# EasyEDA Pro project ProProject_高通AI开发板9.7.epro, schematic Schematic1

## Sheets
1 cam_mem: Create Date: 2024-09-07; Page Name: cam_mem; Project Name: 高通AI开发板9.7; Schematic Name: Schematic1; Update Date: 2024-09-07; Company: 嘉立创EDA; Page Size: A4; Version: V1.0
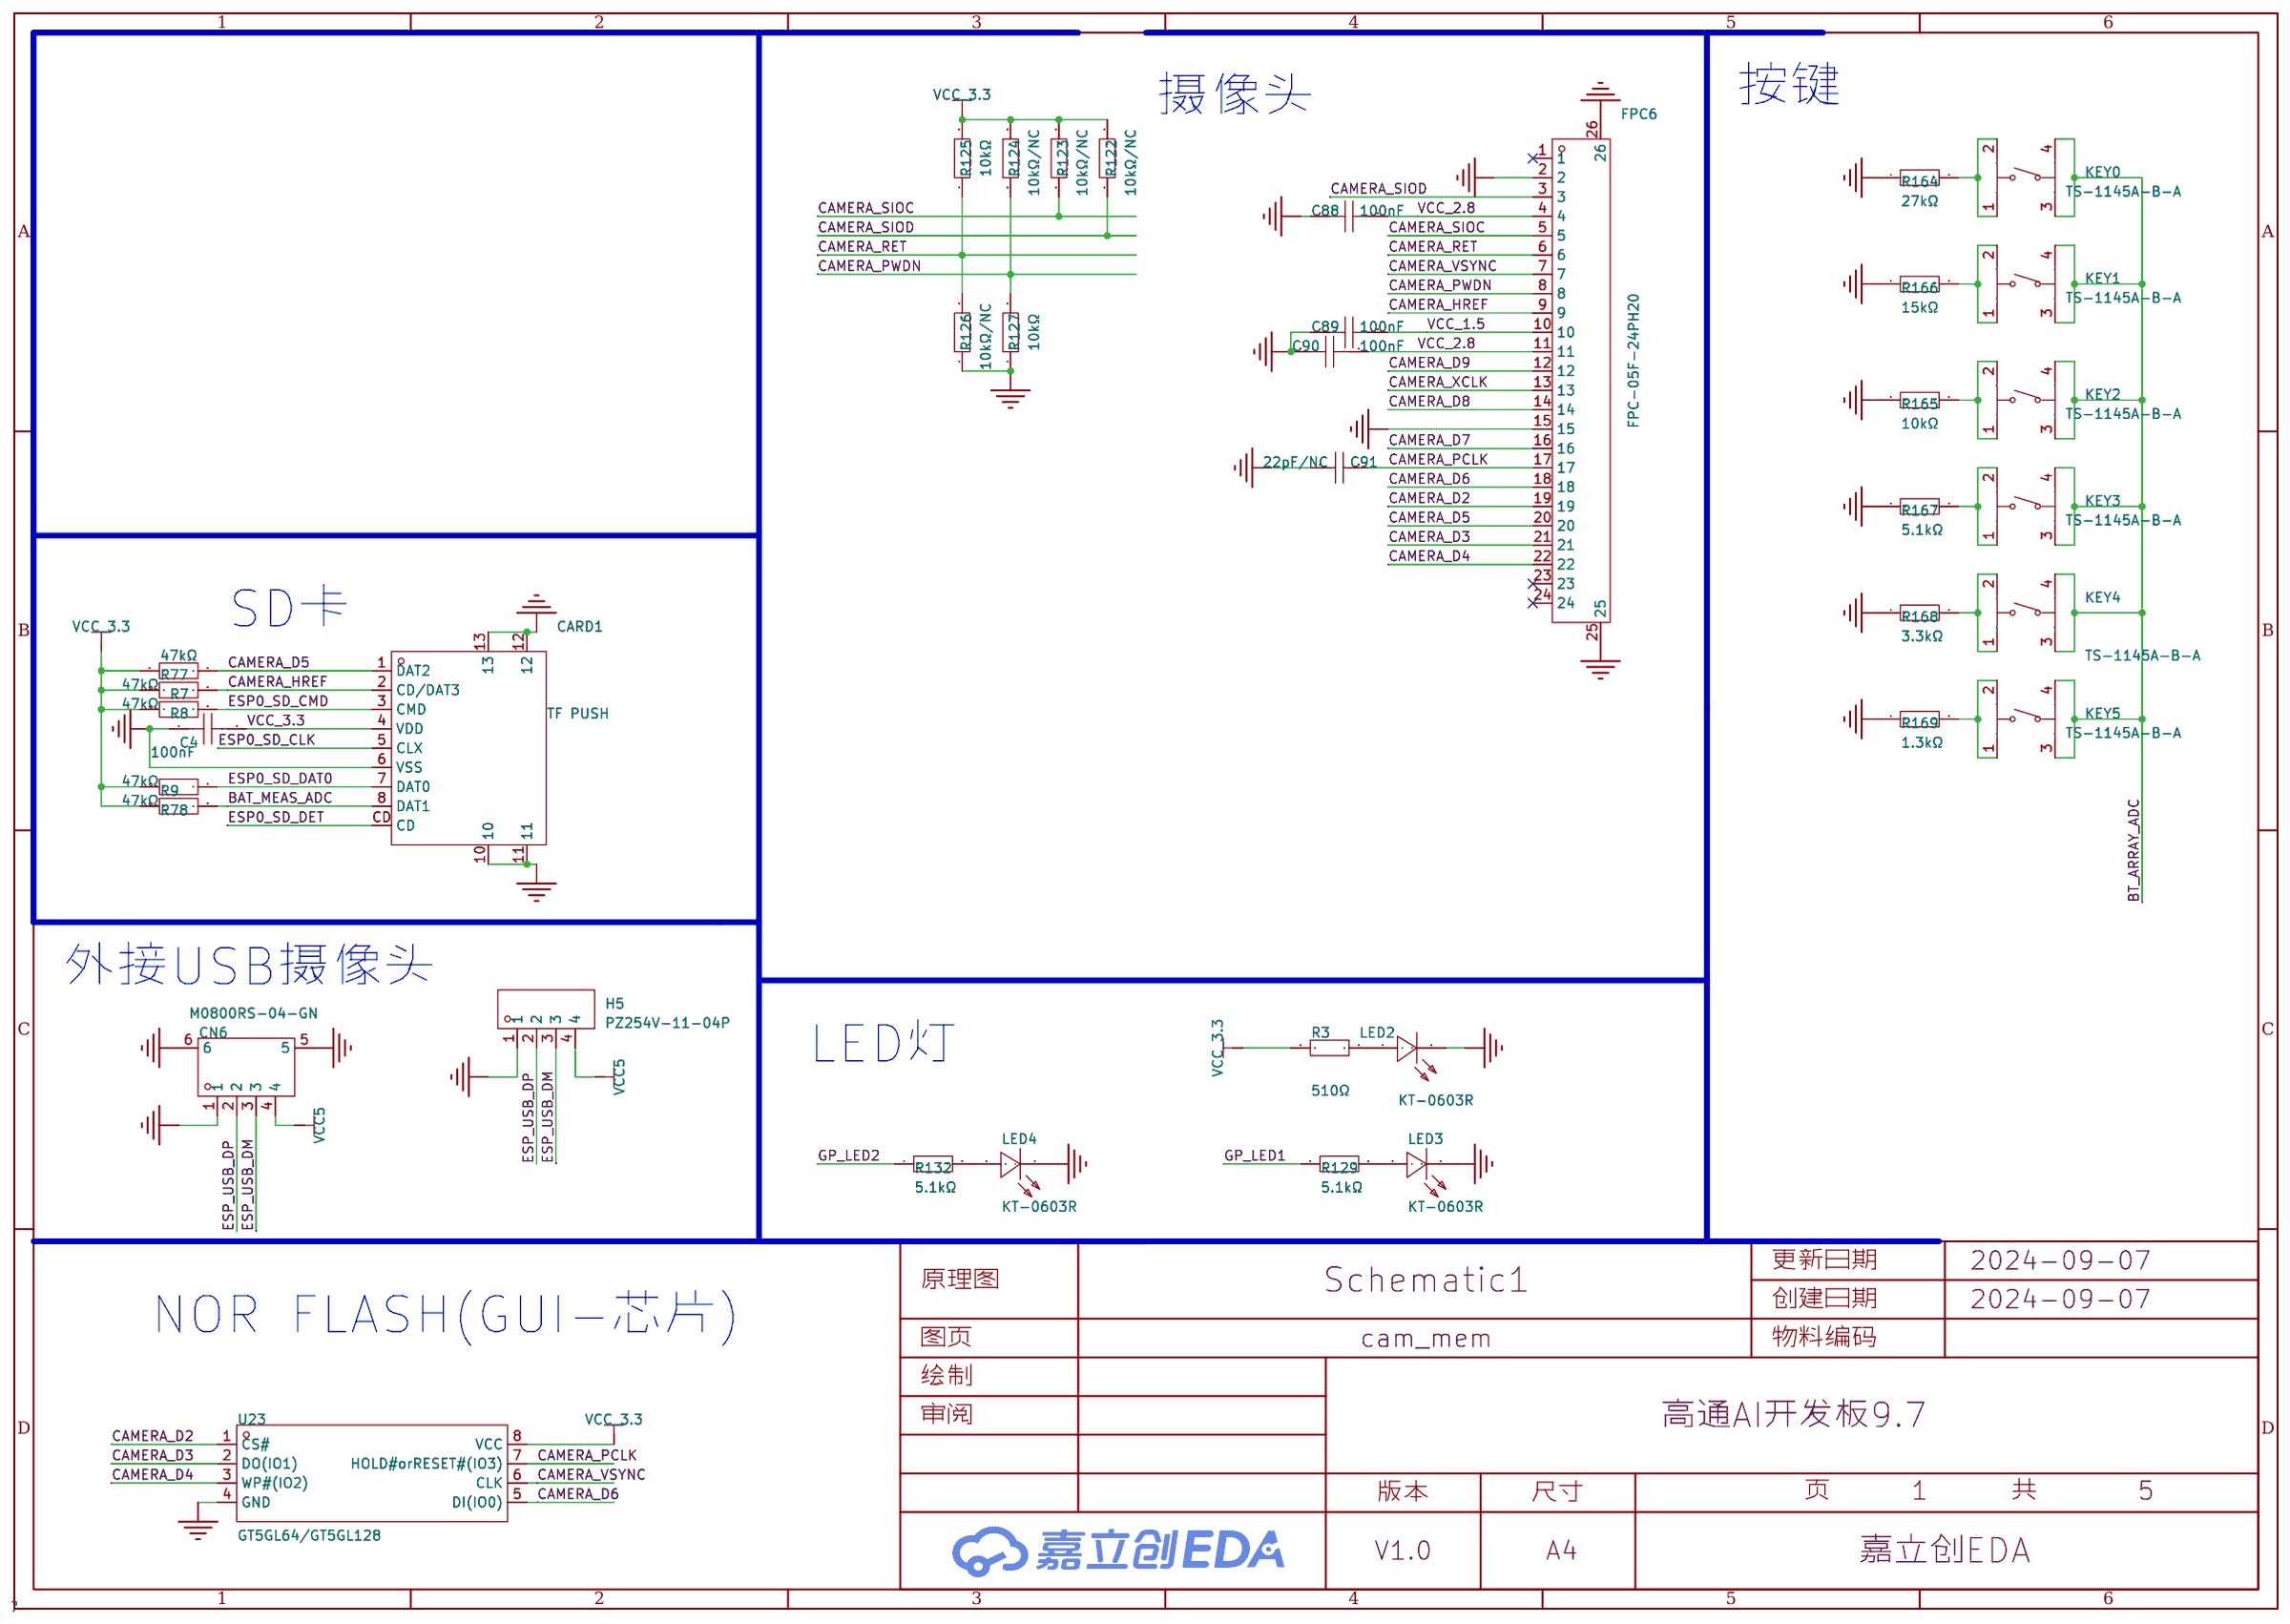
[diagram p0: cam_mem]
2 lcd_usb_uart: Page Name: lcd_usb_uart
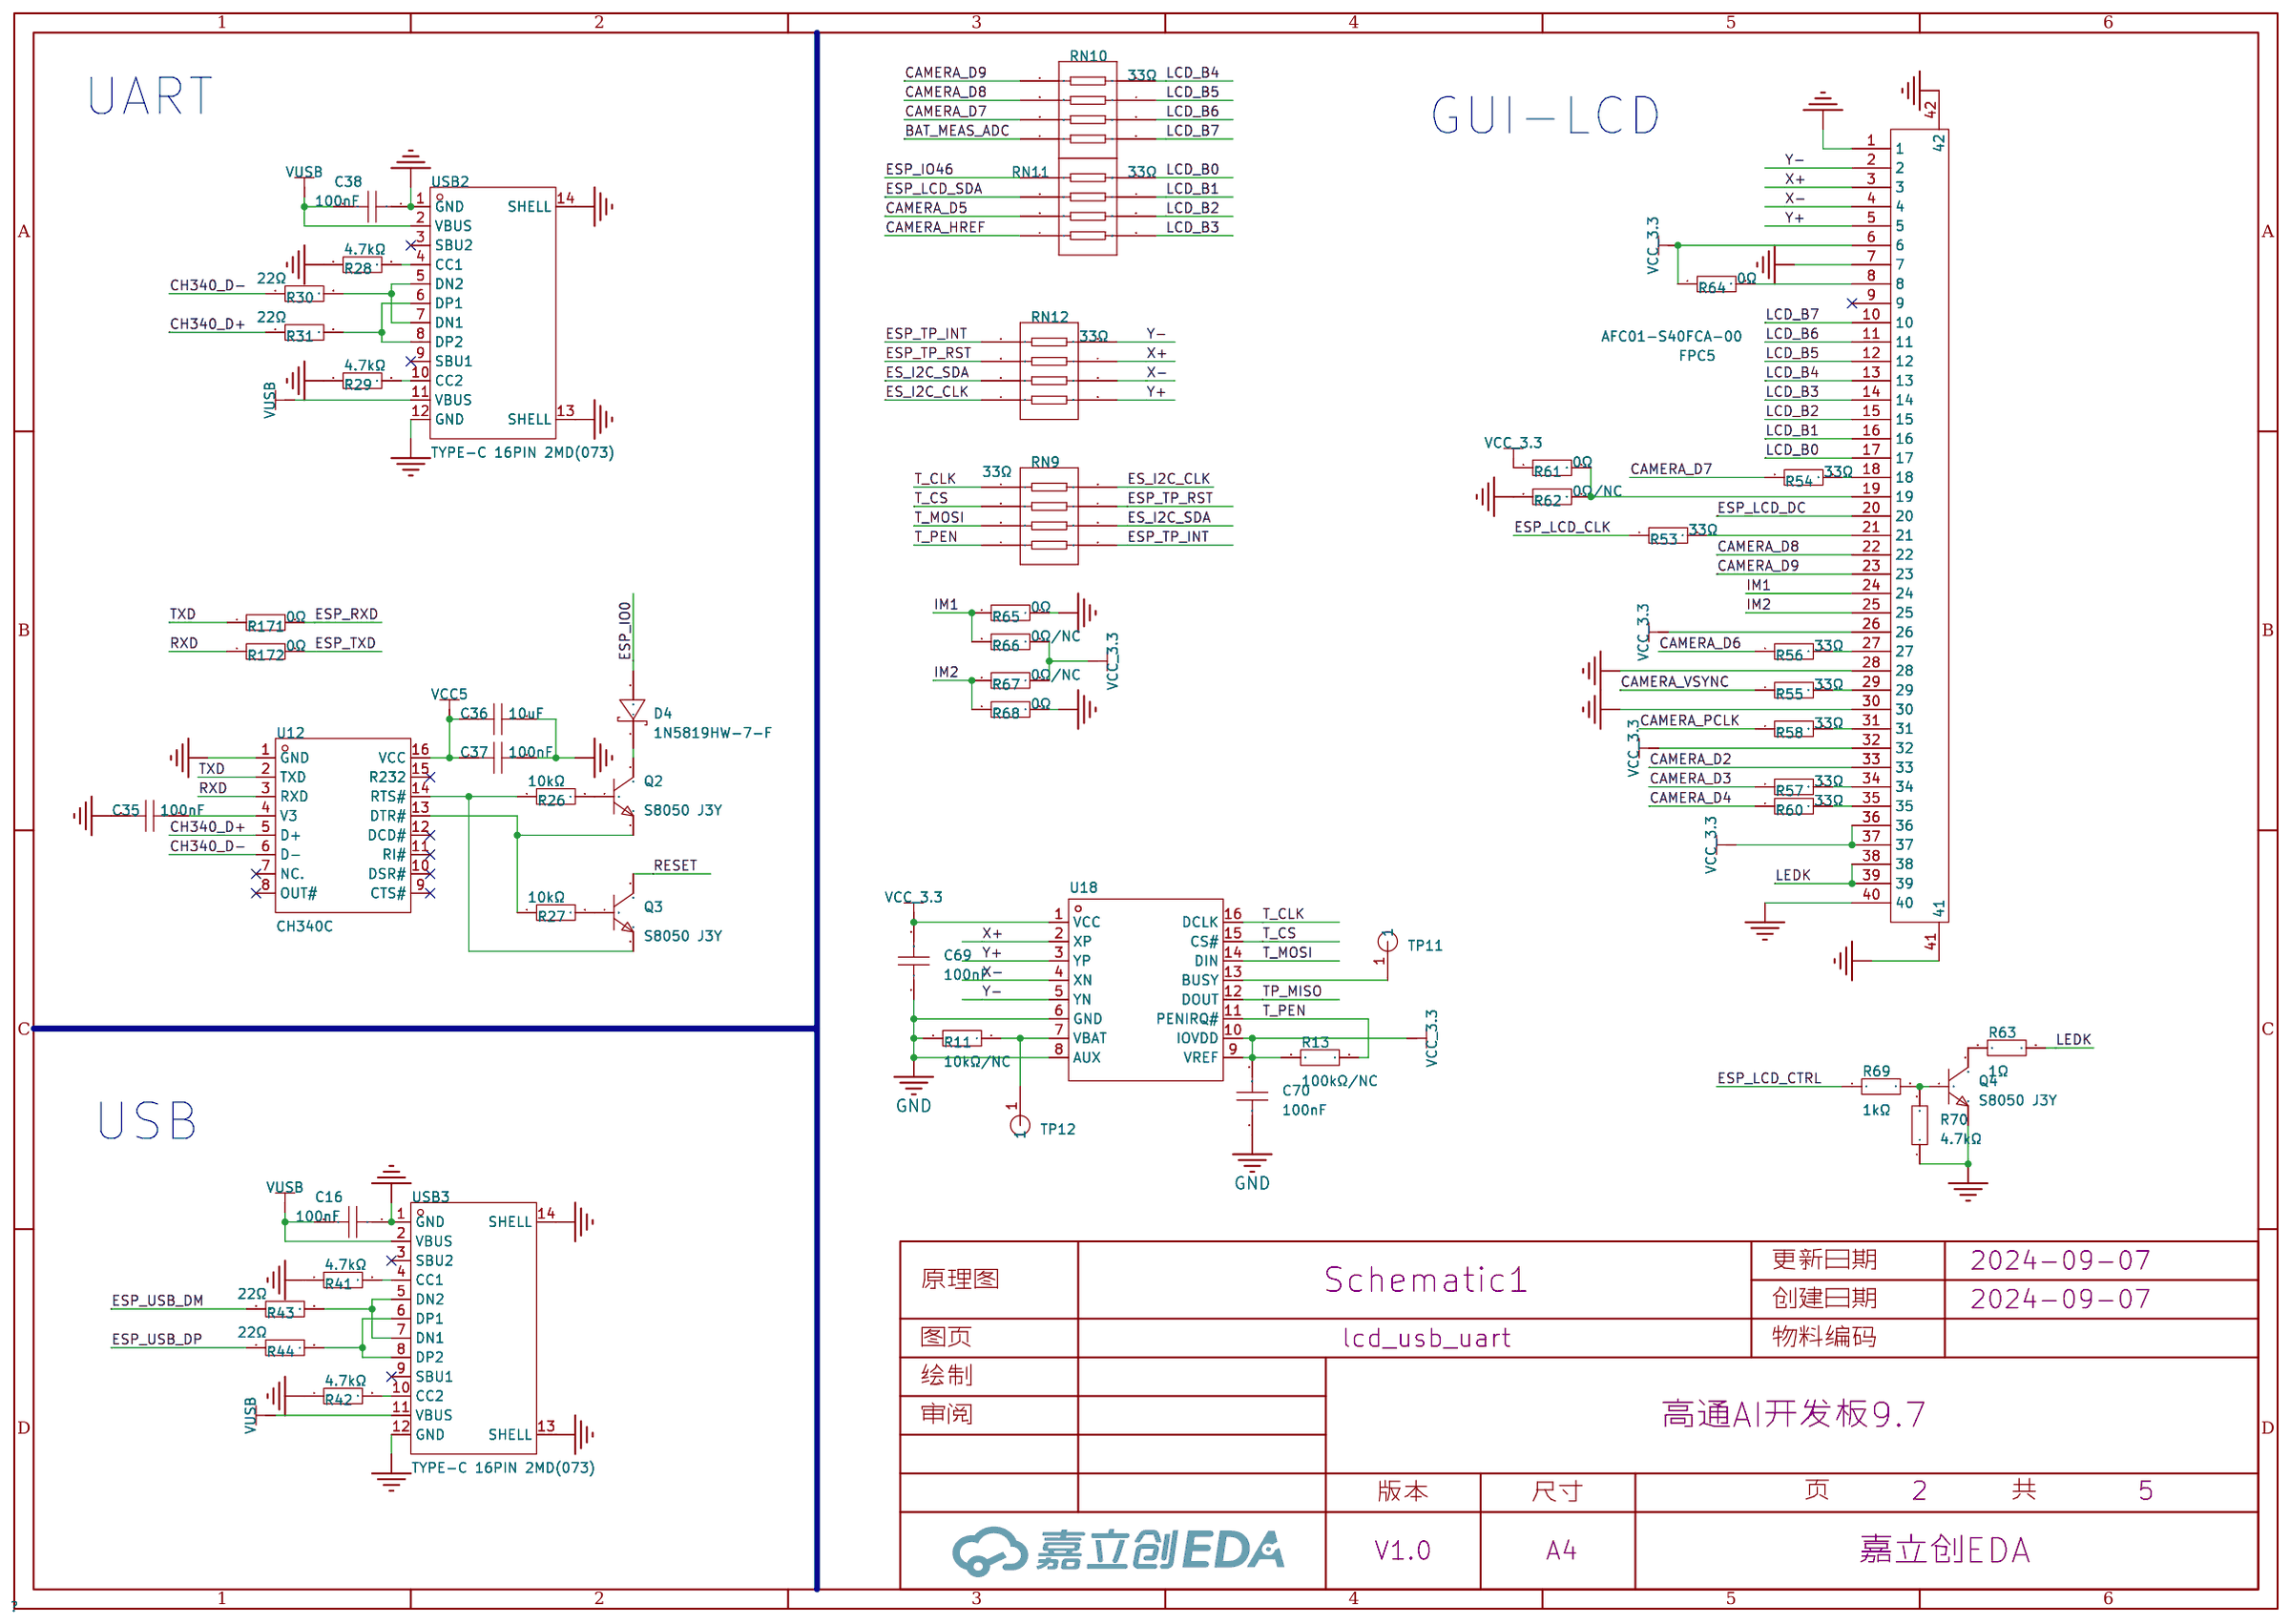
[diagram p1: lcd_usb_uart]
3 mcu_exio_sd: Page Name: mcu_exio_sd
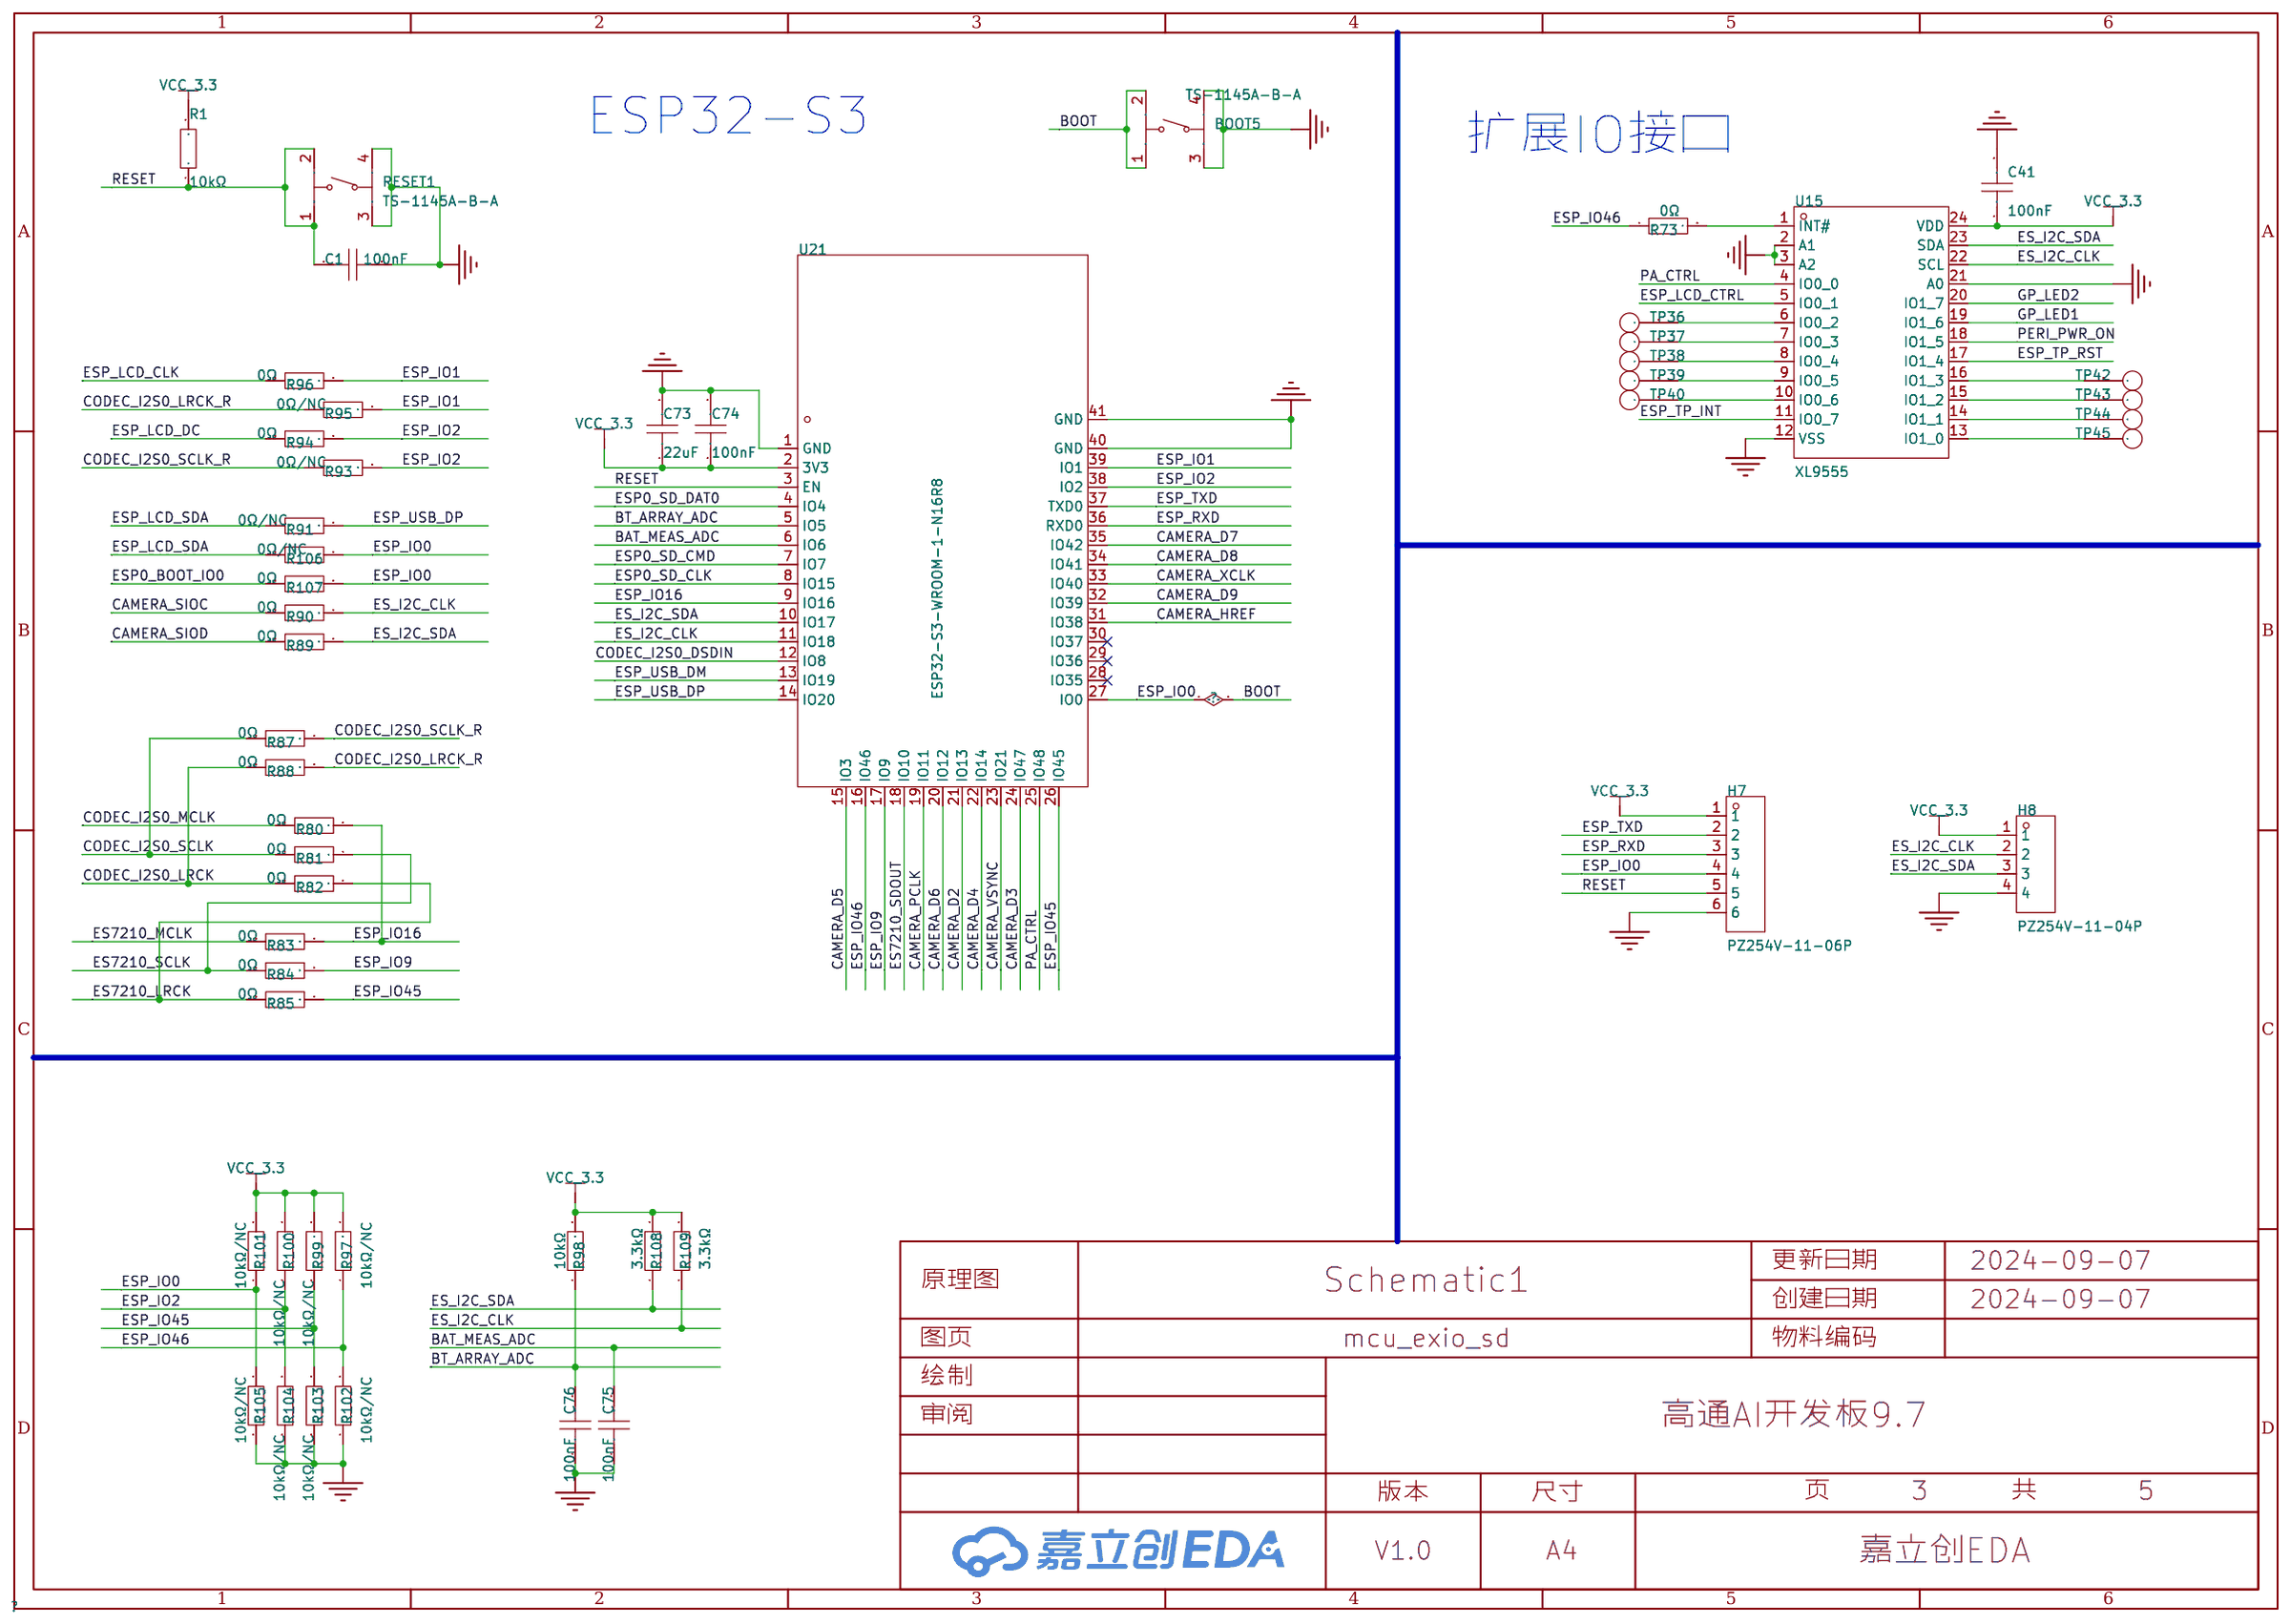
[diagram p2: mcu_exio_sd]
4 audio: Page Name: audio
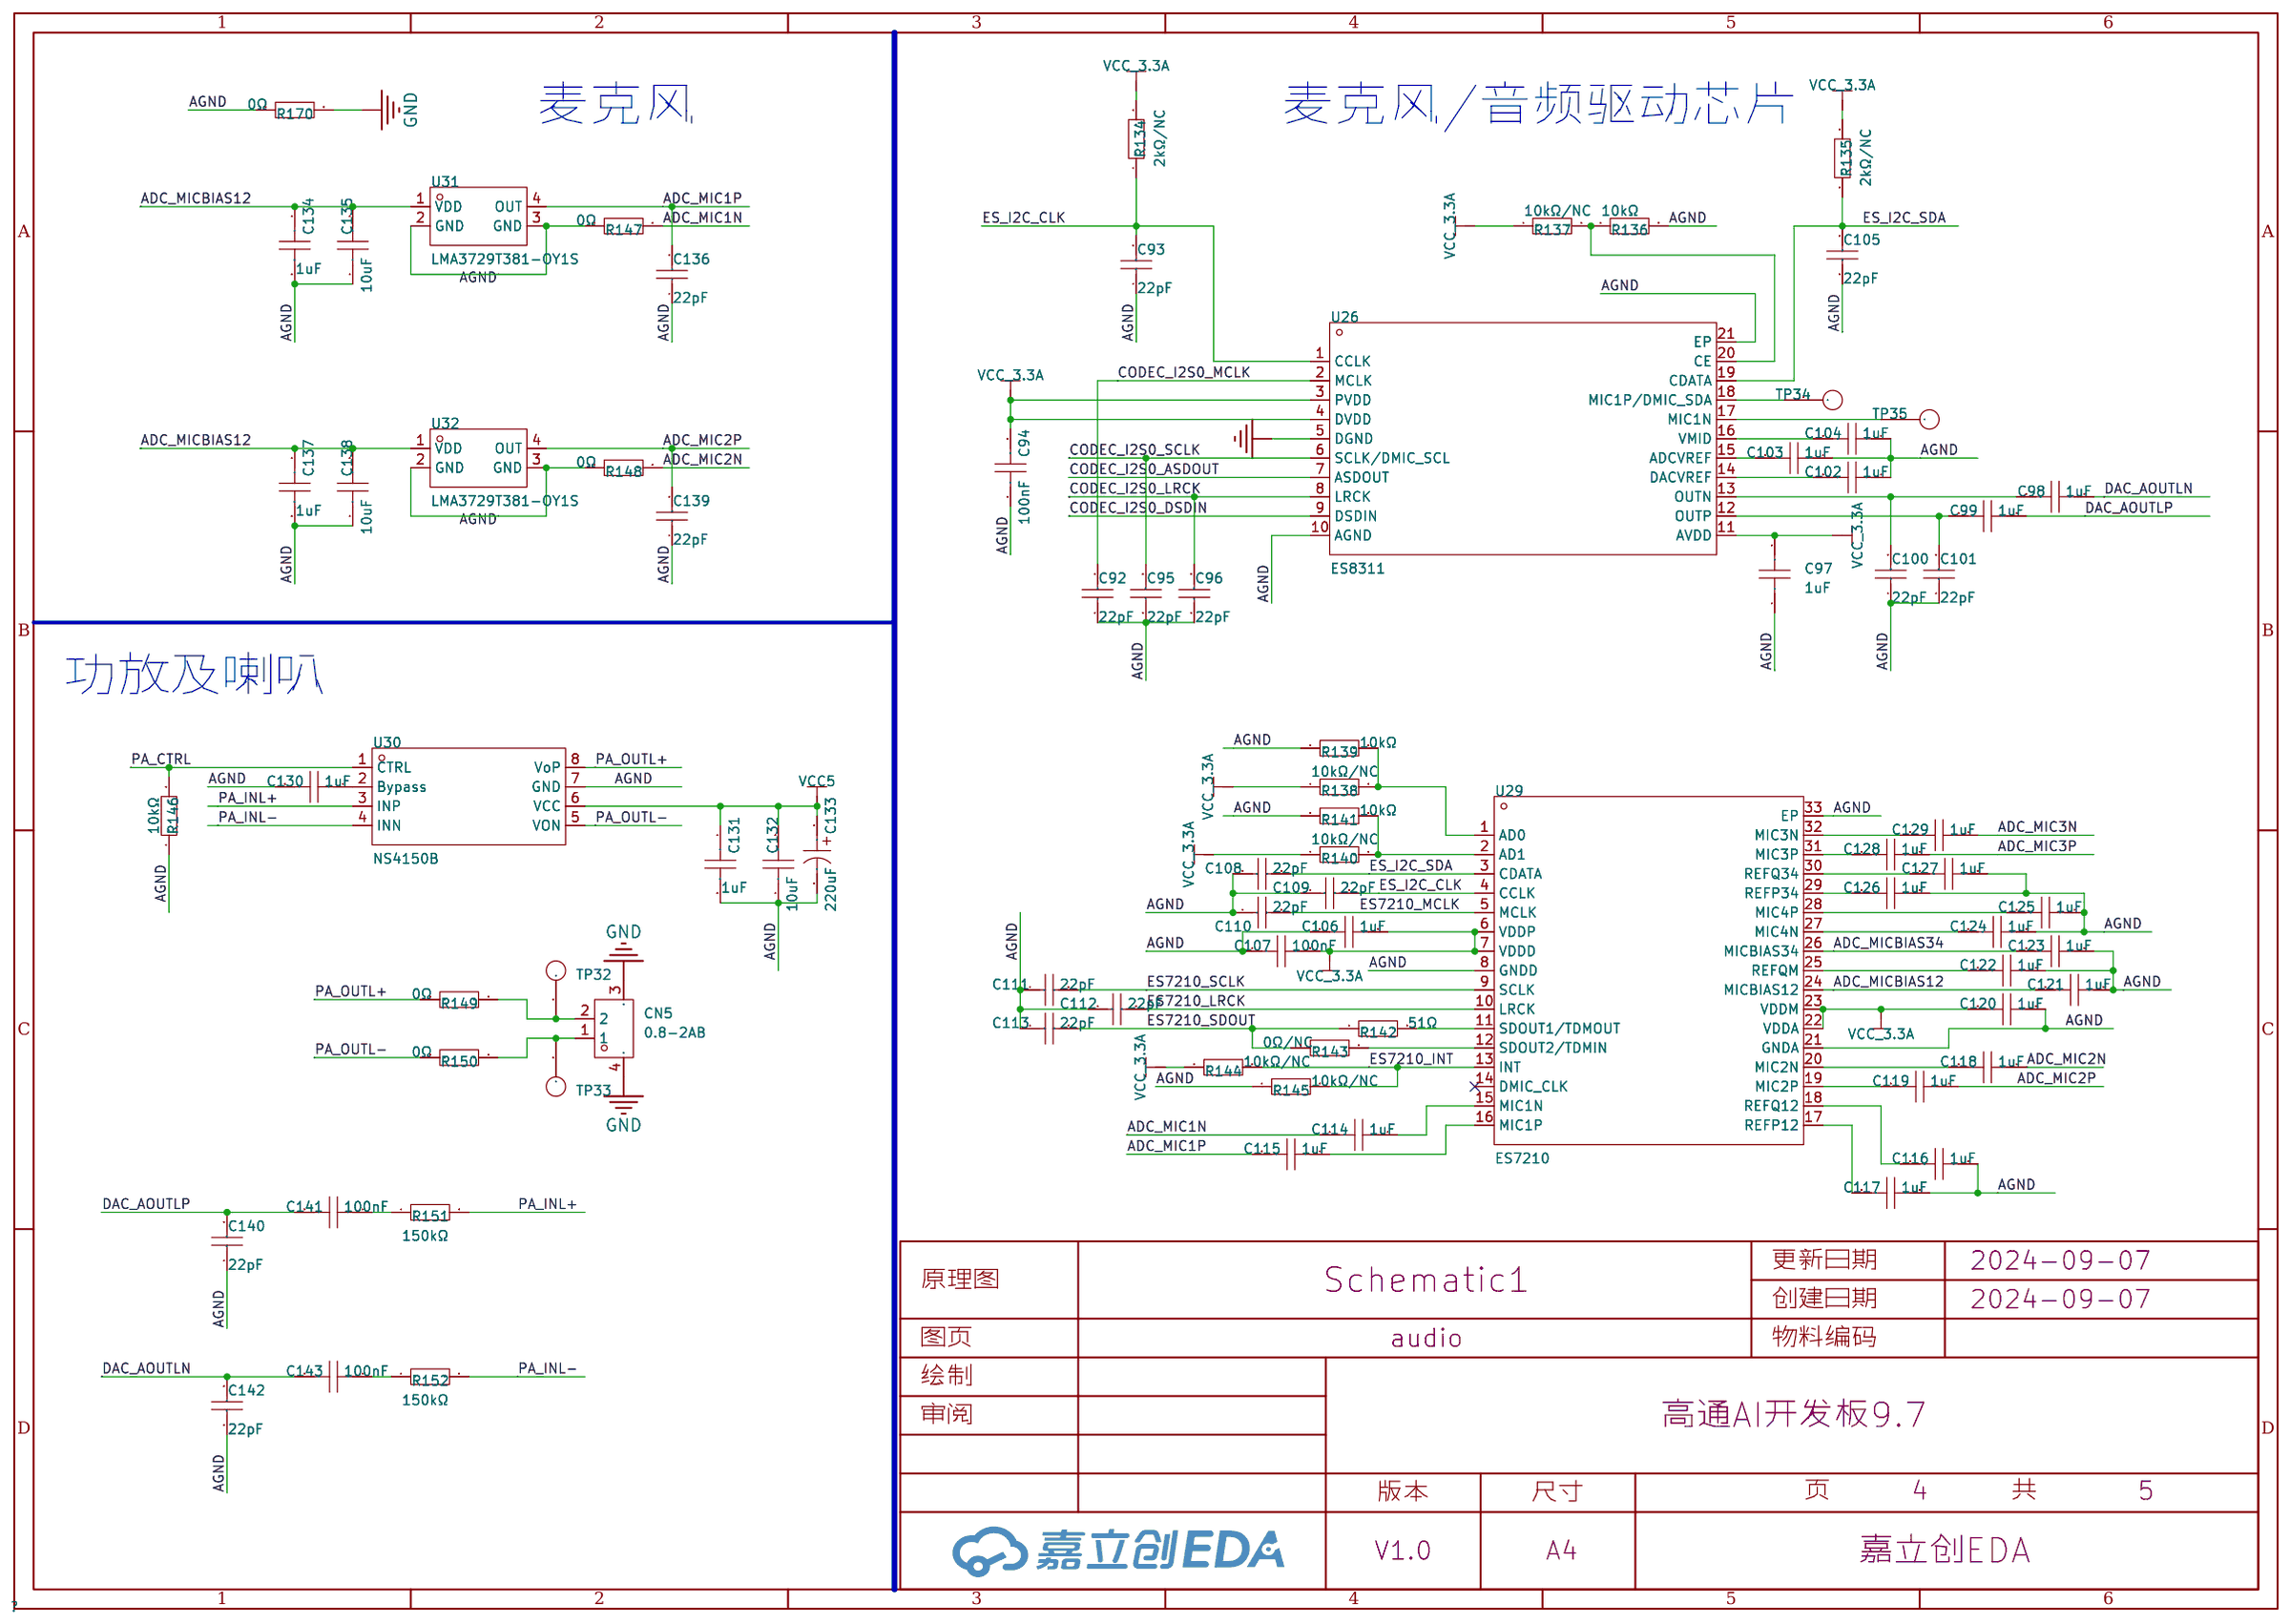
[diagram p3: audio]
5 pwr_aec: Page Name: pwr_aec
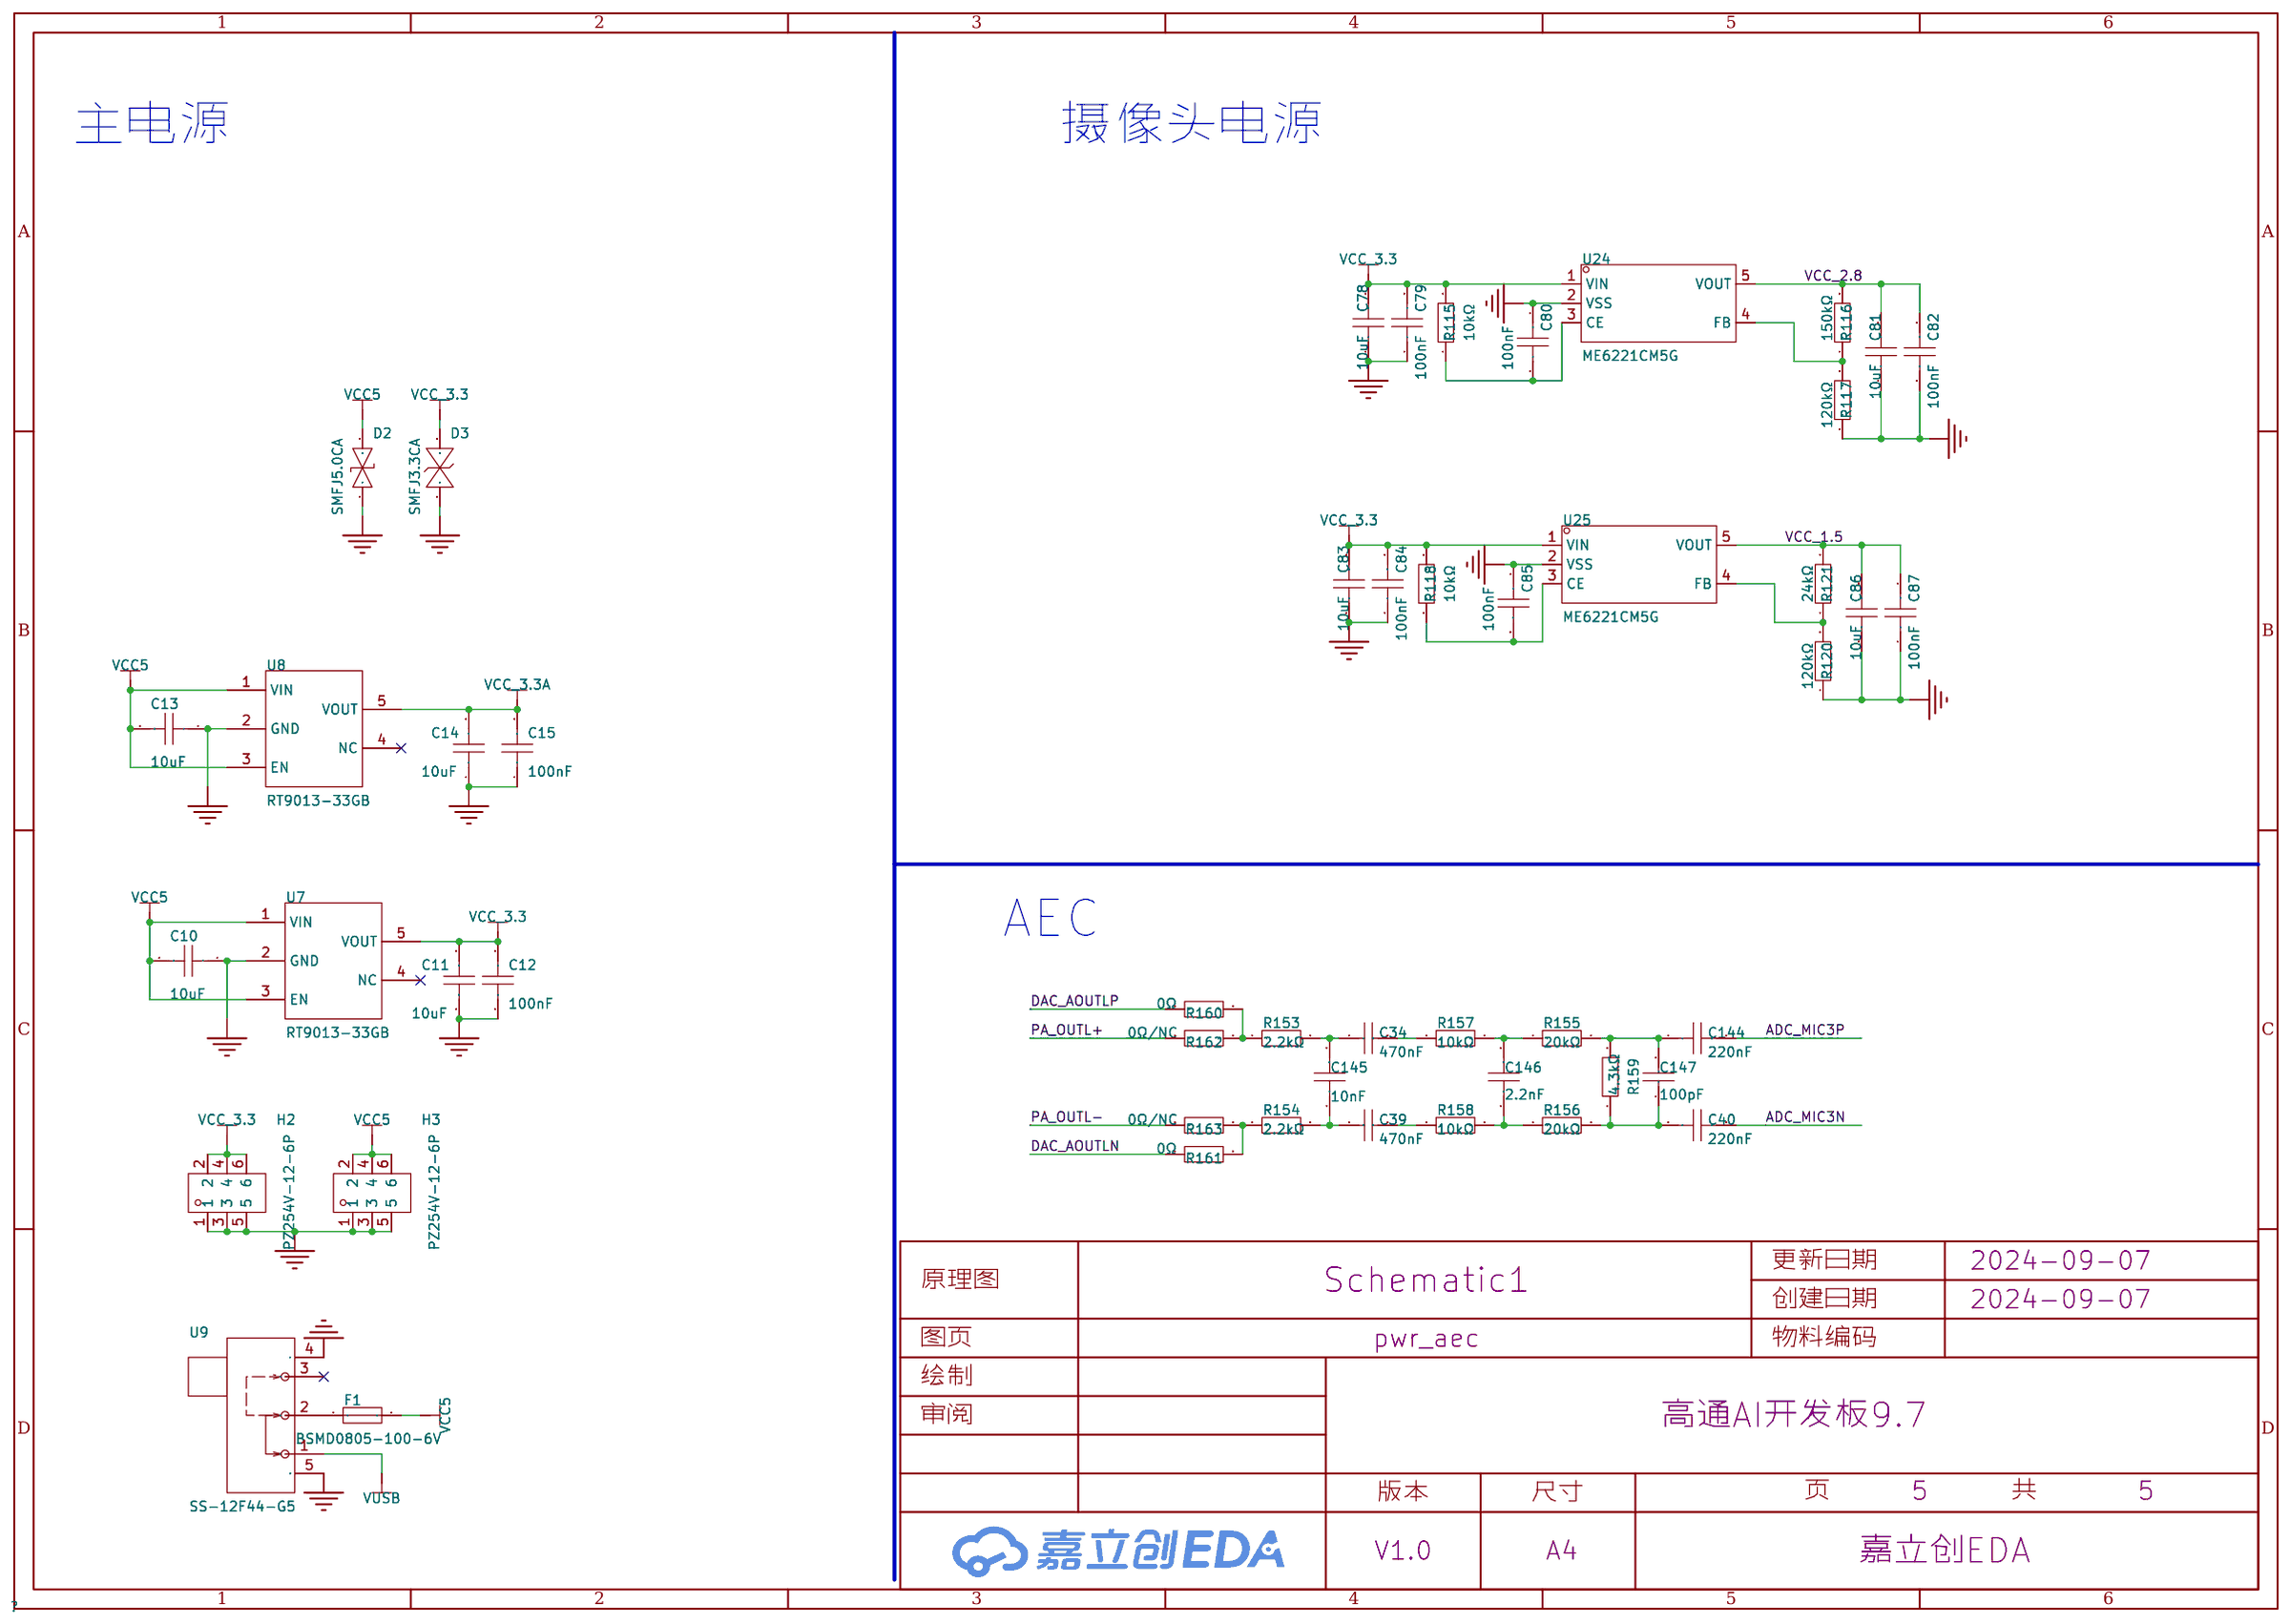
[diagram p4: pwr_aec]

## Parts
sheet audio
C92  22pF  [C0603]
C93  22pF  [C0603]
C94  100nF  [C0603]
C95  22pF  [C0603]
C96  22pF  [C0603]
C97  1uF  [C0603]
C98  1uF  [C0603]
C99  1uF  [C0603]
C100  22pF  [C0603]
C101  22pF  [C0603]
C102  1uF  [C0603]
C103  1uF  [C0603]
C104  1uF  [C0603]
C105  22pF  [C0603]
C106  1uF  [C0603]
C107  100nF  [C0603]
C108  22pF  [C0603]
C109  22pF  [C0603]
C110  22pF  [C0603]
C111  22pF  [C0603]
C112  22pF  [C0603]
C113  22pF  [C0603]
C114  1uF  [C0603]
C115  1uF  [C0603]
C116  1uF  [C0603]
C117  1uF  [C0603]
C118  1uF  [C0603]
C119  1uF  [C0603]
C120  1uF  [C0603]
C121  1uF  [C0603]
C122  1uF  [C0603]
C123  1uF  [C0603]
C124  1uF  [C0603]
C125  1uF  [C0603]
C126  1uF  [C0603]
C127  1uF  [C0603]
C128  1uF  [C0603]
C129  1uF  [C0603]
C130  1uF  [C0603]
C131  1uF  [C0603]
C132  10uF  [C0805]
C133  220uF  [CAP-SMD_BD6.3-L6.6-W6.6-FD]
C134  1uF  [C0603]
C135  10uF  [C0805]
C136  22pF  [C0603]
C137  1uF  [C0603]
C138  10uF  [C0805]
C139  22pF  [C0603]
C140  22pF  [C0603]
C141  100nF  [C0603]
C142  22pF  [C0603]
C143  100nF  [C0603]
CN5  0.8-2AB  [CONN-SMD_2P-P0.80_HCTL_HC-0.8-2PWT]
R134  2kΩ/NC  [R0603]
R135  2kΩ/NC  [R0603]
R136  10kΩ  [R0603]
R137  10kΩ/NC  [R0603]
R138  10kΩ/NC  [R0603]
R139  10kΩ  [R0603]
R140  10kΩ/NC  [R0603]
R141  10kΩ  [R0603]
R142  51Ω  [R0603]
R143  0Ω/NC  [R0603]
R144  10kΩ/NC  [R0603]
R145  10kΩ/NC  [R0603]
R146  10kΩ  [R0603]
R147  0Ω  [R0603]
R148  0Ω  [R0603]
R149  0Ω  [R0603]
R150  0Ω  [R0603]
R151  150kΩ  [R0603]
R152  150kΩ  [R0603]
R170  0Ω  [R0603]
TP32  -  [测试点]
TP33  -  [测试点]
TP34  -  [测试点]
TP35  -  [测试点]
U26  ES8311  [WQFN-20_L3.0-W3.0-P0.40-BL-EP1.7]
U29  ES7210  [QFN-32_L4.0-W4.0-P0.40-BL-EP2.7]
U30  NS4150B  [MSOP-8_L3.0-W3.0-P0.65-LS5.0-BL]
U31  LMA3729T381-OY1S  [MIC-SMD_4P-L3.8-W3.0-P2.46-S1.70-TR-1]
U32  LMA3729T381-OY1S  [MIC-SMD_4P-L3.8-W3.0-P2.46-S1.70-TR-1]
sheet cam_mem
C4  100nF  [C0603]
C88  100nF  [C0603]
C89  100nF  [C0603]
C90  100nF  [C0603]
C91  22pF/NC  [C0603]
CARD1  TF PUSH  [TF-SMD_TF-PUSH]
CN6  M0800RS-04-GN  [CONN-SMD_M0800RS-04-GN]
FPC6  FPC-05F-24PH20  [FPC-SMD_24P-P0.50_FPC-05F-24PH20]
H5  PZ254V-11-04P  [HDR-TH_4P-P2.54-V-M]
KEY0  TS-1145A-B-A  [SW-SMD_4P-L4.2-W3.2-P2.15-LS5.2]
KEY1  TS-1145A-B-A  [SW-SMD_4P-L4.2-W3.2-P2.15-LS5.2]
KEY2  TS-1145A-B-A  [SW-SMD_4P-L4.2-W3.2-P2.15-LS5.2]
KEY3  TS-1145A-B-A  [SW-SMD_4P-L4.2-W3.2-P2.15-LS5.2]
KEY4  TS-1145A-B-A  [SW-SMD_4P-L4.2-W3.2-P2.15-LS5.2]
KEY5  TS-1145A-B-A  [SW-SMD_4P-L4.2-W3.2-P2.15-LS5.2]
LED2  KT-0603R  [LED0603-RD]
LED3  KT-0603R  [LED0603-RD]
LED4  KT-0603R  [LED0603-RD]
R3  510Ω  [R0603]
R7  47kΩ  [R0603]
R8  47kΩ  [R0603]
R9  47kΩ  [R0603]
R77  47kΩ  [R0603]
R78  47kΩ  [R0603]
R122  10kΩ/NC  [R0603]
R123  10kΩ/NC  [R0603]
R124  10kΩ/NC  [R0603]
R125  10kΩ  [R0603]
R126  10kΩ/NC  [R0603]
R127  10kΩ  [R0603]
R129  5.1kΩ  [R0603]
R132  5.1kΩ  [R0603]
R164  27kΩ  [R0603]
R165  10kΩ  [R0603]
R166  15kΩ  [R0603]
R167  5.1kΩ  [R0603]
R168  3.3kΩ  [R0603]
R169  1.3kΩ  [R0603]
U23  GT5GL64/GT5GL128  [SOIC-8_L5.3-W5.3-P1.27-LS8.0-BL]
sheet lcd_usb_uart
C16  100nF  [C0603]
C35  100nF  [C0603]
C36  10uF  [C0805]
C37  100nF  [C0603]
C38  100nF  [C0603]
C69  100nF  [C0603]
C70  100nF  [C0603]
D4  1N5819HW-7-F  [SOD-123_L2.7-W1.6-LS3.7-RD]
FPC5  AFC01-S40FCA-00  [FPC-SMD_P0.50-40P_FGS-XJ-H2.0]
Q2  S8050 J3Y  [SOT-23-3_L3.0-W1.7-P0.95-LS2.9-BR]
Q3  S8050 J3Y  [SOT-23-3_L3.0-W1.7-P0.95-LS2.9-BR]
Q4  S8050 J3Y  [SOT-23-3_L3.0-W1.7-P0.95-LS2.9-BR]
R11  10kΩ/NC  [R0603]
R13  100kΩ/NC  [R0603]
R26  10kΩ  [R0603]
R27  10kΩ  [R0603]
R28  4.7kΩ  [R0603]
R29  4.7kΩ  [R0603]
R30  22Ω  [R0603]
R31  22Ω  [R0603]
R41  4.7kΩ  [R0603]
R42  4.7kΩ  [R0603]
R43  22Ω  [R0603]
R44  22Ω  [R0603]
R53  33Ω  [R0603]
R54  33Ω  [R0603]
R55  33Ω  [R0603]
R56  33Ω  [R0603]
R57  33Ω  [R0603]
R58  33Ω  [R0603]
R60  33Ω  [R0603]
R61  0Ω  [R0603]
R62  0Ω/NC  [R0603]
R63  1Ω  [R0603]
R64  0Ω  [R0603]
R65  0Ω  [R0603]
R66  0Ω/NC  [R0603]
R67  0Ω/NC  [R0603]
R68  0Ω  [R0603]
R69  1kΩ  [R0603]
R70  4.7kΩ  [R0603]
R171  0Ω  [R0603]
R172  0Ω  [R0603]
RN9  33Ω  [RES-ARRAY-SMD_0603-8P-L3.2-W1.6-BL]
RN10  33Ω  [RES-ARRAY-SMD_0603-8P-L3.2-W1.6-BL]
RN11  33Ω  [RES-ARRAY-SMD_0603-8P-L3.2-W1.6-BL]
RN12  33Ω  [RES-ARRAY-SMD_0603-8P-L3.2-W1.6-BL]
TP11  -  [TP]
TP12  -  [TP]
U12  CH340C  [SOP-16_L10.0-W3.9-P1.27-LS6.0-BL]
U18  -  [TSSOP-16_L5.0-W4.4-P0.65-LS6.4-BL]
USB2  TYPE-C 16PIN 2MD(073)  [USB-C-SMD_TYPE-C-6PIN-2MD-073]
USB3  TYPE-C 16PIN 2MD(073)  [USB-C-SMD_TYPE-C-6PIN-2MD-073]
sheet mcu_exio_sd
BOOT5  TS-1145A-B-A  [SW-SMD_4P-L4.2-W3.2-P2.15-LS5.2]
C1  100nF  [C0603]
C41  100nF  [C0603]
C73  22uF  [C0805]
C74  100nF  [C0603]
C75  100nF  [C0603]
C76  100nF  [C0603]
H7  PZ254V-11-06P  [HDR-TH_6P-P2.54-V-M]
H8  PZ254V-11-04P  [HDR-TH_4P-P2.54-V-M]
R1  10kΩ  [R0603]
R73  0Ω  [R0603]
R80  0Ω  [R0603]
R81  0Ω  [R0603]
R82  0Ω  [R0603]
R83  0Ω  [R0603]
R84  0Ω  [R0603]
R85  0Ω  [R0603]
R87  0Ω  [R0603]
R88  0Ω  [R0603]
R89  0Ω  [R0603]
R90  0Ω  [R0603]
R91  0Ω/NC  [R0603]
R93  0Ω/NC  [R0603]
R94  0Ω  [R0603]
R95  0Ω/NC  [R0603]
R96  0Ω  [R0603]
R97  10kΩ/NC  [R0603]
R98  10kΩ  [R0603]
R99  10kΩ/NC  [R0603]
R100  10kΩ/NC  [R0603]
R101  10kΩ/NC  [R0603]
R102  10kΩ/NC  [R0603]
R103  10kΩ/NC  [R0603]
R104  10kΩ/NC  [R0603]
R105  10kΩ/NC  [R0603]
R106  0Ω/NC  [R0603]
R107  0Ω  [R0603]
R108  3.3kΩ  [R0603]
R109  3.3kΩ  [R0603]
RESET1  TS-1145A-B-A  [SW-SMD_4P-L4.2-W3.2-P2.15-LS5.2]
TP36  -  [测试点]
TP37  -  [测试点]
TP38  -  [测试点]
TP39  -  [测试点]
TP40  -  [测试点]
TP42  -  [测试点]
TP43  -  [测试点]
TP44  -  [测试点]
TP45  -  [测试点]
U15  XL9555  [TSSOP-24_L7.8-W4.4-P0.65-LS6.4-BL]
U21  ESP32-S3-WROOM-1-N16R8  [WIRELM-SMD_ESP32-S3-WROOM-1]
sheet pwr_aec
C10  10uF  [C0805]
C11  10uF  [C0805]
C12  100nF  [C0603]
C13  10uF  [C0805]
C14  10uF  [C0805]
C15  100nF  [C0603]
C34  470nF  [C0603]
C39  470nF  [C0603]
C40  220nF  [C0603]
C78  10uF  [C0805]
C79  100nF  [C0603]
C80  100nF  [C0603]
C81  10uF  [C0805]
C82  100nF  [C0603]
C83  10uF  [C0805]
C84  100nF  [C0603]
C85  100nF  [C0603]
C86  10uF  [C0805]
C87  100nF  [C0603]
C144  220nF  [C0603]
C145  10nF  [C0603]
C146  2.2nF  [C0603]
C147  100pF  [C0603]
D2  SMFJ5.0CA  [SOD-123FL_L2.8-W1.8-LS3.7-BI]
D3  SMFJ3.3CA  [SOD-123_L2.7-W1.6-LS3.7-BI]
F1  BSMD0805-100-6V  [F0805]
H2  PZ254V-12-6P  [HDR-TH_6P-P2.54-V-M-R2-C3-S2.54]
H3  PZ254V-12-6P  [HDR-TH_6P-P2.54-V-M-R2-C3-S2.54]
R115  10kΩ  [R0603]
R116  150kΩ  [R0603]
R117  120kΩ  [R0603]
R118  10kΩ  [R0603]
R120  120kΩ  [R0603]
R121  24kΩ  [R0603]
R153  2.2kΩ  [R0603]
R154  2.2kΩ  [R0603]
R155  20kΩ  [R0603]
R156  20kΩ  [R0603]
R157  10kΩ  [R0603]
R158  10kΩ  [R0603]
R159  4.3kΩ  [R0603]
R160  0Ω  [R0603]
R161  0Ω  [R0603]
R162  0Ω/NC  [R0603]
R163  0Ω/NC  [R0603]
U7  RT9013-33GB  [SOT-23-5_L3.0-W1.7-P0.95-LS2.8-BL]
U8  RT9013-33GB  [SOT-23-5_L3.0-W1.7-P0.95-LS2.8-BL]
U9  SS-12F44-G5  [SW-TH_SS-12F44-G5_C2998807]
U24  ME6221CM5G  [SOT-23-5_L3.0-W1.7-P0.95-LS2.8-BR]
U25  ME6221CM5G  [SOT-23-5_L3.0-W1.7-P0.95-LS2.8-BR]

## Library data of the parts
C91-C93 C95 C96 C100 C101 C105 C108-C113 C136 C139 C140 C142 = CL10C220JB8NNNC: 容值:22pF;精度:±5%;额定电压:50V;材质(温度系数):C0G;; LCSC Part Name: 22pF ±5% 50V; Supplier Part: C1653; Manufacturer: SAMSUNG(三星); Supplier Footprint: 0603; JLCPCB Part Class: 基础库; Datasheet: https://atta.szlcsc.com/upload/public/pdf/source/20160218/1457707763339.pdf; Supplier: LCSC; Tolerance: ±5%; Voltage Rated: 50V; Temperature Coefficient: C0G
C1 C4 C12 C15 C16 C35 C37 C38 C41 C74-C76 C79 C80 C82 C84 C85 C87-C90 C94 C107 C141 C143 = CC0603KRX7R9BB104: 容值:100nF;精度:±10%;额定电压:50V;材质(温度系数):X7R;; LCSC Part Name: 100nF ±10% 50V; Supplier Part: C14663; Manufacturer: YAGEO(国巨); Supplier Footprint: 0603; JLCPCB Part Class: 基础库; Datasheet: https://atta.szlcsc.com/upload/public/pdf/source/20180910/C282072_33301C7F631E79921B82A8DAC6BCC5B3.pdf; Supplier: LCSC; Tolerance: ±10%; Voltage Rated: 50V; Temperature Coefficient: X7R
C97-C99 C102-C104 C106 C114-C131 C134 C137 = CL10A105KB8NNNC: 容值:1uF;精度:±10%;额定电压:50V;材质(温度系数):X5R;; LCSC Part Name: 1uF ±10% 50V; Supplier Part: C15849; Manufacturer: SAMSUNG(三星); Supplier Footprint: 0603; JLCPCB Part Class: 基础库; Datasheet: https://atta.szlcsc.com/upload/public/pdf/source/20160218/1457707763339.pdf; Supplier: LCSC; Tolerance: ±10%; Voltage Rated: 50V; Temperature Coefficient: X5R
C10 C11 C13 C14 C36 C78 C81 C83 C86 C132 C135 C138 = CL21A106KAYNNNE_C15850: 容值:10uF;精度:±10%;额定电压:25V;材质(温度系数):X5R;; LCSC Part Name: 10uF ±10% 25V; Supplier Part: C15850; Manufacturer: SAMSUNG(三星); Manufacturer Part: CL21A106KAYNNNE; Supplier Footprint: 0805; JLCPCB Part Class: 基础库; Datasheet: https://atta.szlcsc.com/upload/public/pdf/source/20160218/1457707763339.pdf; Supplier: LCSC; Tolerance: ±10%; Voltage Rated: 25V; Temperature Coefficient: X5R
C133 = RVT220UF16V67RV0015: 容值:220uF;精度:±20%;额定电压:16V;纹波电流:110mA@120Hz;等效串联电阻:-;; LCSC Part Name: 220uF ±20% 16V; Supplier Part: C2887273; Manufacturer: KNSCHA(科尼盛); Supplier Footprint: SMD,D6.3xL7.7mm; JLCPCB Part Class: 扩展库; Datasheet: https://atta.szlcsc.com/upload/public/pdf/source/20210824/3DC9999D9B098FE241E3A26137981C4C.pdf; Supplier: LCSC; Tolerance: ±20%; Rated Voltage: 16V; Ripple Current: 110mA@120Hz; φD: 6.3mm; L: 7.7mm; Lifetime @ Temp: 2000hrs@105℃; Operating Temperature: -55℃~+105℃
CN5 = HC-0.8-2PWT: 参考系列:-;间距:0.8mm;插针结构:1x2P;排数:1;每排PIN数:2;行距:-;公母:公型插针;安装方式:卧贴;额定电流:500mA;工作温度范围:-25~+85;; LCSC Part Name: 2P 卧贴 间距P=0.8mm; Supplier Part: C2845343; Manufacturer: HCTL(华灿天禄); Supplier Footprint: SMD,P=0.8mm; JLCPCB Part Class: Extended Part; Datasheet: https://atta.szlcsc.com/upload/public/pdf/source/20210728/C2845343_61511A56FAB5371B8B04E1D045EB70C5.pdf; Supplier: LCSC; Pitch: 0.8mm; Pins Structure: 1x2P; Number of Rows: 1; Number of PINs Per Row: 2; Gender: 公型插针; Mounting Style: 卧贴; Current Rating (Max): 500mA; Operating Temperature Range: -25~+85
R134 R135 = 0603WAF2001T5E: 电阻类型:厚膜电阻;阻值:2kΩ;精度:±1%;功率:100mW;最大工作电压:75V;温度系数:±100ppm/℃;; LCSC Part Name: 2kΩ ±1% 100mW 厚膜电阻; Supplier Part: C22975; Manufacturer: UNI-ROYAL(厚声); Supplier Footprint: 0603; JLCPCB Part Class: 基础库; Datasheet: https://atta.szlcsc.com/upload/public/pdf/source/20200306/C422600_1E6D84923E4A46A82E41ADD87F860B5C.pdf; Supplier: LCSC; Type: 厚膜电阻; Tolerance: ±1%; Power(Watts): 100mW; Overload Voltage (Max): 75V; Temperature Coefficient: ±100ppm/℃; Operating Temperature Range: -55℃~+155℃
R1 R26 R27 R97-R105 R115 R118 R122-R127 R136-R141 R144-R146 R165 = 0603WAF1002T5E: 电阻类型:厚膜电阻;阻值:10kΩ;精度:±1%;功率:100mW;最大工作电压:75V;温度系数:±100ppm/℃;; LCSC Part Name: 厚膜电阻 10kΩ ±1% 100mW; Supplier Part: C25804; Manufacturer: UNI-ROYAL(厚声); Supplier Footprint: 0603; JLCPCB Part Class: 基础库; Datasheet: https://atta.szlcsc.com/upload/public/pdf/source/20200306/C422600_1E6D84923E4A46A82E41ADD87F860B5C.pdf; Supplier: LCSC; Type: 厚膜电阻; Tolerance: ±1%; Power(Watts): 100mW; Overload Voltage (Max): 75V; Temperature Coefficient: ±100ppm/℃; Operating Temperature Range: -55℃~+155℃
R142 = 0603WAF510JT5E: 电阻类型:厚膜电阻;阻值:51Ω;精度:±1%;功率:100mW;最大工作电压:75V;温度系数:±100ppm/℃;; LCSC Part Name: 51Ω ±1% 100mW 厚膜电阻; Supplier Part: C23197; Manufacturer: UNI-ROYAL(厚声); Supplier Footprint: 0603; JLCPCB Part Class: 基础库; Datasheet: https://atta.szlcsc.com/upload/public/pdf/source/20200306/C422600_1E6D84923E4A46A82E41ADD87F860B5C.pdf; Supplier: LCSC; Type: 厚膜电阻; Tolerance: ±1%; Power(Watts): 100mW; Overload Voltage (Max): 75V; Temperature Coefficient: ±100ppm/℃; Operating Temperature Range: -55℃~+155℃
R61 R62 R64-R68 R73 R80-R85 R87-R91 R93-R96 R106 R107 R143 R147-R150 R160-R163 R170-R172 = 0603WAF0000T5E: 电阻类型:厚膜电阻;阻值:0Ω;精度:±1%;功率:100mW;最大工作电压:75V;; LCSC Part Name: 0Ω ±1% 100mW 厚膜电阻; Supplier Part: C21189; Manufacturer: UNI-ROYAL(厚声); Supplier Footprint: 0603; JLCPCB Part Class: 基础库; Datasheet: https://atta.szlcsc.com/upload/public/pdf/source/20200306/C422600_1E6D84923E4A46A82E41ADD87F860B5C.pdf; Supplier: LCSC; Type: 厚膜电阻; Tolerance: ±1%; Power(Watts): 100mW; Overload Voltage (Max): 75V; Operating Temperature Range: -55℃~+155℃
R116 R151 R152 = 0603WAF1503T5E: 电阻类型:厚膜电阻;阻值:150kΩ;精度:±1%;功率:100mW;最大工作电压:75V;温度系数:±100ppm/℃;; LCSC Part Name: 150kΩ ±1% 100mW 厚膜电阻; Supplier Part: C22807; Manufacturer: UNI-ROYAL(厚声); Supplier Footprint: 0603; JLCPCB Part Class: 基础库; Datasheet: https://atta.szlcsc.com/upload/public/pdf/source/20200306/C422600_1E6D84923E4A46A82E41ADD87F860B5C.pdf; Supplier: LCSC; Type: 厚膜电阻; Tolerance: ±1%; Power(Watts): 100mW; Overload Voltage (Max): 75V; Temperature Coefficient: ±100ppm/℃; Operating Temperature Range: -55℃~+155℃
TP32-TP40 TP42-TP45 = 测试点
U26 = ES8311: Supplier Part: C962342; Manufacturer: Everest-semi(顺芯); Supplier Footprint: WQFN-20-EP(3x3); JLCPCB Part Class: 扩展库; Datasheet: https://atta.szlcsc.com/upload/public/pdf/source/20210630/C962342_E665EAE7274179BC7C5A390EC8AC685C.pdf; Supplier: LCSC
U29 = ES7210: 供电电压:-；-；-；-；-;; LCSC Part Name: 音频解码芯片; Supplier Part: C365743; Manufacturer: Everest-semi(顺芯); Supplier Footprint: QFN-32-EP(4x4); JLCPCB Part Class: 扩展库; Datasheet: https://atta.szlcsc.com/upload/public/pdf/source/20190124/C365743_EF64B9678A6C48719EEF660F22636096.pdf; Supplier: LCSC; Supply Voltage: -；-；-；-；-; Chip Type Parameters/Description: 音频解码芯片
U30 = NS4150B_C189961: 功放类型:D类功放;输出功率:3Wx1@4Ω;; Supplier Part: C189961; Manufacturer: Nsiway(纳芯威); Supplier Footprint: MSOP-8; JLCPCB Part Class: 扩展库; Datasheet: https://atta.szlcsc.com/upload/public/pdf/source/20220916/DAE631F3909B9CBB38BDE76E3E6D5896.pdf; Supplier: LCSC; Type of Power Amplifier: D类功放; Output Power: 3Wx1@4Ω; Supply Voltage: 3V~5.25V
U31 U32 = LMA3729T381-OY1S: 3729叠层结构硅麦，上进音高灵敏度-32db高snr65db，相位一致性高，适合阵列语音识别; LCSC Part Name: MEMSmic硅麦3729 上进音 s-32db±1 snr65db LMA:聆麦模拟麦克风/3729:尺寸/T:上进音/381:-38±1dB; Supplier Part: C5373240; Manufacturer: LinkMems(聆麦声学); Supplier Footprint: SMD-4P,3.8x3mm; JLCPCB Part Class: 扩展库; Datasheet: https://atta.szlcsc.com/upload/public/pdf/source/20230506/4371D154D859DD405435B53B68B23A9C.pdf; Supplier: LCSC
CARD1 = TF PUSH: 卡连接方式:自弹式;卡类型:MicroSD卡(TF卡);连接器类型:卡座;本体最大高度:2mm;触头材质:-;触头镀层:-;工作温度范围:-20℃~+90℃;焊接温度(最大值):-;; LCSC Part Name: 自弹式 MicroSD卡(TF卡) 卡座; Supplier Part: C393941; Manufacturer: SHOU HAN(首韩); Supplier Footprint: SMD; JLCPCB Part Class: 扩展库; Datasheet: https://atta.szlcsc.com/upload/public/pdf/source/20191011/C393941_0DDD896EE907FEB750D8B7B8982E2A67.pdf; Supplier: LCSC; Card Connection Mode: 自弹式; Card Type: MicroSD卡(TF卡); Connector Type: 卡座; Maximum Body Height: 2mm; Operating Temperature Range: -20℃~+90℃; Additional Card Detection Pins: 无
CN6 = M0800RS-04-GN: 插针结构:1x4P;间距:0.8mm;安装方式:卧贴;参考系列:-;总PIN数:4P;排数:1;每排PIN数:4;行距:-;额定电流:-;工作温度范围:-;; LCSC Part Name: 1x4P 间距:0.8mm 卧贴; Supplier Part: C509166; Manufacturer: XFCN(兴飞); Supplier Footprint: SMD,P=0.8mm,卧贴; JLCPCB Part Class: 扩展库; Datasheet: https://atta.szlcsc.com/upload/public/pdf/source/20200407/C509164_BF52F945AC88792F216409D296077FAE.pdf; Supplier: LCSC; Pins Structure: 1x4P; Pitch: 0.8mm; Mounting Style: 卧贴; Number of Pins: 4P; Number of Rows: 1; Number of PINs Per Row: 4
FPC6 = FPC-05F-24PH20: 锁定特性:翻盖式;触点类型:下接;触点数量:24P;间距:0.5mm;安装类型:卧贴;工作温度范围:-25℃~+85℃;; LCSC Part Name: 间距:0.5mm P数:24P 翻盖式 下接; Supplier Part: C2856805; Manufacturer: XUNPU(讯普); Supplier Footprint: SMD,P=0.5mm,卧贴; JLCPCB Part Class: 扩展库; Datasheet: https://atta.szlcsc.com/upload/public/pdf/source/20210922/C2856805_8542C20E2D7FF0FC4EEBD919AE0F6905.pdf; Supplier: LCSC; Locking Feature: 翻盖式; Contact Type: 下接; Number of Contacts: 24P; Pitch: 0.5mm; Mounting Type: 卧贴; FFC, FCB Thickness: 0.3mm; Height Above Board: 2mm; Operating Temperature Range: -25℃~+85℃
H5 H8 = PZ254V-11-04P: 插针结构:1x4P;间距:2.54mm;行距:-;圆针/方针:方针;安装类型:直插;排数:单排;总PIN位数:4P;额定电流:3A;额定电压:250V;配合针长度:6mm;塑高:2.5mm;端接针长度:3mm;触头材质:-;工作温度范围:-40℃~+105℃;颜色:黑色;; LCSC Part Name: 间距:2.54mm 1x4P 直插 方针; Supplier Part: C2691448; Manufacturer: XFCN(兴飞); Supplier Footprint: 插件,P=2.54mm; JLCPCB Part Class: 扩展库; Datasheet: https://atta.szlcsc.com/upload/public/pdf/source/20200309/C492403_F9F19131791D08044AD4F84F8E751A34.pdf; Supplier: LCSC; Pin Structure: 1x4P; Pitch: 2.54mm; Circluar Pins/Square Pins: 方针; Mounting Type: 直插; Number of Rows: 单排; Number of Pins: 4P; Current Rating (Max): 3A; Voltage Rating (Max): 250V; Length of Mating Pin: 6mm; Insulation Height: 2.5mm; Length of End Connection Pin: 3mm; Operating Temperature Range: -40℃~+105℃; Color: 黑色
BOOT5 KEY0-KEY5 RESET1 = TS-1145A-B-A: 电路结构:单刀单掷;按钮形状:椭圆形按钮;作用力:160gf;安装方式:立贴;开关长度:4.2mm;开关宽度:3.2mm;开关高度:2.5mm;带支架:不带;触点电流:50mA;额定电压(DC):12V;绝缘电阻:-;带灯:无;机械寿命:10万次;; LCSC Part Name: 4.2*3.2*2.5mm 立贴 轻触开关; Supplier Part: C318904; Manufacturer: XKB Connectivity(中国星坤); Supplier Footprint: SMD; JLCPCB Part Class: 扩展库; Datasheet: https://atta.szlcsc.com/upload/public/pdf/source/20211011/FC00869C3CE33BCCD344D072F551E76B.pdf; Supplier: LCSC; Circuit: 单刀单掷; Actuator Style: 椭圆形按钮; Operating Force: 160gf; Mounting Style: 立贴; Switch Length: 4.2mm; Switch Width: 3.2mm; Switch Height: 2.5mm; Strike Gundam: 不带; Contact Current: 50mA; Voltage Rating (DC): 12V; Actuator/Cap Color: 白色; With Lamp: 无; Mechanical Life: 10万次; Operating Temperature: -30℃~+85℃
LED2-LED4 = KT-0603R: 发光颜色:红色;功率:-;正向电流:-;主波长:-;二极管配置:-;透镜颜色:-;色温:-;发光角度:-;载带方式:-;工作温度:-40℃~+85℃;; LCSC Part Name: 0603 红灯 高亮; Supplier Part: C2286; Manufacturer: KENTO; Supplier Footprint: 0603; JLCPCB Part Class: 基础库; Datasheet: https://atta.szlcsc.com/upload/public/pdf/source/20160616/1466072038404.pdf; Supplier: LCSC; Emitted Color: 红色; Operating Temperature: -40℃~+85℃
R3 = 0603WAF5100T5E: 电阻类型:厚膜电阻;阻值:510Ω;精度:±1%;功率:100mW;最大工作电压:75V;温度系数:±100ppm/℃;; LCSC Part Name: 510Ω ±1% 100mW 厚膜电阻; Supplier Part: C23193; Manufacturer: UNI-ROYAL(厚声); Supplier Footprint: 0603; JLCPCB Part Class: 基础库; Datasheet: https://atta.szlcsc.com/upload/public/pdf/source/20200306/C422600_1E6D84923E4A46A82E41ADD87F860B5C.pdf; Supplier: LCSC; Type: 厚膜电阻; Tolerance: ±1%; Power(Watts): 100mW; Overload Voltage (Max): 75V; Temperature Coefficient: ±100ppm/℃; Operating Temperature Range: -55℃~+155℃
R7-R9 R77 R78 = 0603WAF4702T5E: 电阻类型:厚膜电阻;阻值:47kΩ;精度:±1%;功率:100mW;最大工作电压:75V;温度系数:±100ppm/℃;; LCSC Part Name: 47kΩ ±1% 100mW 厚膜电阻; Supplier Part: C25819; Manufacturer: UNI-ROYAL(厚声); Supplier Footprint: 0603; JLCPCB Part Class: 基础库; Datasheet: https://atta.szlcsc.com/upload/public/pdf/source/20200306/C422600_1E6D84923E4A46A82E41ADD87F860B5C.pdf; Supplier: LCSC; Type: 厚膜电阻; Tolerance: ±1%; Power(Watts): 100mW; Overload Voltage (Max): 75V; Temperature Coefficient: ±100ppm/℃; Operating Temperature Range: -55℃~+155℃
R129 R132 R167 = 0603WAF5101T5E: 电阻类型:厚膜电阻;阻值:5.1kΩ;精度:±1%;功率:100mW;最大工作电压:75V;温度系数:±100ppm/℃;; LCSC Part Name: 5.1kΩ ±1% 100mW 厚膜电阻; Supplier Part: C23186; Manufacturer: UNI-ROYAL(厚声); Supplier Footprint: 0603; JLCPCB Part Class: 基础库; Datasheet: https://atta.szlcsc.com/upload/public/pdf/source/20200306/C422600_1E6D84923E4A46A82E41ADD87F860B5C.pdf; Supplier: LCSC; Type: 厚膜电阻; Tolerance: ±1%; Power(Watts): 100mW; Overload Voltage (Max): 75V; Temperature Coefficient: ±100ppm/℃; Operating Temperature Range: -55℃~+155℃
R164 = 0603WAF2702T5E: 电阻类型:厚膜电阻;阻值:27kΩ;精度:±1%;功率:100mW;最大工作电压:75V;温度系数:±100ppm/℃;; LCSC Part Name: 27kΩ ±1% 100mW 厚膜电阻; Supplier Part: C22967; Manufacturer: UNI-ROYAL(厚声); Supplier Footprint: 0603; JLCPCB Part Class: 基础库; Datasheet: https://atta.szlcsc.com/upload/public/pdf/source/20200306/C422600_1E6D84923E4A46A82E41ADD87F860B5C.pdf; Supplier: LCSC; Type: 厚膜电阻; Tolerance: ±1%; Power(Watts): 100mW; Overload Voltage (Max): 75V; Temperature Coefficient: ±100ppm/℃; Operating Temperature Range: -55℃~+155℃
R166 = 0603WAF1502T5E: 电阻类型:厚膜电阻;阻值:15kΩ;精度:±1%;功率:100mW;最大工作电压:75V;温度系数:±100ppm/℃;; LCSC Part Name: 15kΩ ±1% 100mW 厚膜电阻; Supplier Part: C22809; Manufacturer: UNI-ROYAL(厚声); Supplier Footprint: 0603; JLCPCB Part Class: 基础库; Datasheet: https://atta.szlcsc.com/upload/public/pdf/source/20200306/C422600_1E6D84923E4A46A82E41ADD87F860B5C.pdf; Supplier: LCSC; Type: 厚膜电阻; Tolerance: ±1%; Power(Watts): 100mW; Overload Voltage (Max): 75V; Temperature Coefficient: ±100ppm/℃; Operating Temperature Range: -55℃~+155℃
R108 R109 R168 = 0603WAF3301T5E: 电阻类型:厚膜电阻;阻值:3.3kΩ;精度:±1%;功率:100mW;最大工作电压:75V;温度系数:±100ppm/℃;; LCSC Part Name: 3.3kΩ ±1% 100mW 厚膜电阻; Supplier Part: C22978; Manufacturer: UNI-ROYAL(厚声); Supplier Footprint: 0603; JLCPCB Part Class: 基础库; Datasheet: https://atta.szlcsc.com/upload/public/pdf/source/20200306/C422600_1E6D84923E4A46A82E41ADD87F860B5C.pdf; Supplier: LCSC; Type: 厚膜电阻; Tolerance: ±1%; Power(Watts): 100mW; Overload Voltage (Max): 75V; Temperature Coefficient: ±100ppm/℃; Operating Temperature Range: -55℃~+155℃
R169 = 0603WAF1301T5E: 电阻类型:厚膜电阻;阻值:1.3kΩ;精度:±1%;功率:100mW;最大工作电压:75V;温度系数:±100ppm/℃;; LCSC Part Name: 1.3kΩ ±1% 100mW 厚膜电阻; Supplier Part: C22767; Manufacturer: UNI-ROYAL(厚声); Supplier Footprint: 0603; JLCPCB Part Class: 扩展库; Datasheet: https://atta.szlcsc.com/upload/public/pdf/source/20200306/C422600_1E6D84923E4A46A82E41ADD87F860B5C.pdf; Supplier: LCSC; Type: 厚膜电阻; Tolerance: ±1%; Power(Watts): 100mW; Overload Voltage (Max): 75V; Temperature Coefficient: ±100ppm/℃; Operating Temperature Range: -55℃~+155℃
U23 = W25Q64JVSSIQ: Supplier Part: C179171; Manufacturer: WINBOND(华邦); Supplier Footprint: SOIC-8-208mil; JLCPCB Part Class: 扩展库; Datasheet: https://atta.szlcsc.com/upload/public/pdf/source/20191218/C179171_92C5C91D0324539EDD8F1160D2E79C0F.pdf; Supplier: LCSC
C69 C70 = CL10B104KA8NNNC: 容值:100nF;精度:±10%;额定电压:25V;材质(温度系数):X7R;; LCSC Part Name: 100nF ±10% 25V; Supplier Part: C1590; Manufacturer: SAMSUNG(三星); Supplier Footprint: 0603; JLCPCB Part Class: Extended Part; Datasheet: https://atta.szlcsc.com/upload/public/pdf/source/20160103/1457707680294.pdf; Supplier: LCSC; Tolerance: ±10%; Voltage Rated: 25V; Temperature Coefficient: X7R
D4 = 1N5819HW-7-F: 正向压降(Vf):450mV@1A;直流反向耐压(Vr):40V;平均整流电流(Io):1A;; LCSC Part Name: 电压:40V 电流:1A; Supplier Part: C82544; Manufacturer: DIODES(美台); Supplier Footprint: SOD-123; JLCPCB Part Class: 扩展库; Datasheet: https://atta.szlcsc.com/upload/public/pdf/source/20161024/1477288459223.pdf; Supplier: LCSC; Forward Voltage (Vf@If): 450mV@1A; Reverse Voltage (Vr): 40V; Average Rectified Current (Io): 1A; Reverse Leakage Current (Ir): 1mA@40V
FPC5 = AFC01-S40FCA-00: 锁定特性:翻盖式;触点类型:下接;触点数量:40P;间距:0.5mm;安装类型:卧贴;; LCSC Part Name: 间距:0.5mm P数:40P 翻盖式 下接; Supplier Part: C262674; Manufacturer: JS(钜硕电子); Supplier Footprint: SMD,P=0.5mm,卧贴; JLCPCB Part Class: 扩展库; Datasheet: https://atta.szlcsc.com/upload/public/pdf/source/20190816/C413942_2A72D1AC756EAE17EEDF756A339D4500.pdf; Supplier: LCSC; Locking Feature: 翻盖式; Contact Type: 下接; Number of Contacts: 40P; Pitch: 0.5mm; Mounting Type: 卧贴; FFC, FCB Thickness: 0.3mm; Height Above Board: 2mm
Q2-Q4 = S8050 J3Y_C2146: 晶体管类型:NPN;集电极电流(Ic):500mA;集射极击穿电压(Vceo):25V;功率(Pd):300mW;直流电流增益(hFE@Ic,Vce):200@50mA,1V;; LCSC Part Name: S8050 J3Y(RANGE:200-350) H档(200-350); Supplier Part: C2146; Manufacturer: CJ(江苏长电/长晶); Supplier Footprint: SOT-23; JLCPCB Part Class: 基础库; Datasheet: https://atta.szlcsc.com/upload/public/pdf/source/20140809/1457707209234.pdf; Supplier: LCSC; Transistor Type: NPN; Collector Current (Ic): 500mA; Collector-Emitter Breakdown Voltage (Vceo): 25V; Power Dissipation (Pd): 300mW; DC Current Gain (hFE@Ic,Vce): 200@50mA,1V; Transition Frequency (fT): 150MHz; Collector Cut-Off Current (Icbo): 100nA; Collector-Emitter Saturation Voltage (VCE(sat)@Ic,Ib): 600mV@500mA,50mA
R11 = RMC060310K5%N: 阻值:10kΩ;精度:±5%;功率:100mW;; LCSC Part Name: 10kΩ ±5% 100mW; Supplier Part: C269684; Manufacturer: Tyohm(幸亚电阻); Supplier Footprint: 0603; JLCPCB Part Class: Extended Part; Datasheet: https://atta.szlcsc.com/upload/public/pdf/source/20190115/C269684_8D87CA5E93509225B329A05891D1141E.pdf; Supplier: LCSC; Tolerance: ±5%; Power(Watts): 100mW
R13 = RC0603FR-07100KL: 阻值:100kΩ;精度:±1%;功率:100mW;温度系数:±100ppm/;最大工作电压:75V;工作温度范围:-55~+155;; LCSC Part Name: 100kΩ ±1%; Supplier Part: C14675; Manufacturer: YAGEO(国巨); Supplier Footprint: 0603; JLCPCB Part Class: Extended Part; Datasheet: https://atta.szlcsc.com/upload/public/pdf/source/20140324/1457707028752.pdf; Supplier: LCSC; Tolerance: ±1%; Power(Watts): 100mW; Temperature Coefficient: ±100ppm/; Overload Voltage (Max): 75V; Operating Temperature Range: -55~+155
R28 R29 R41 R42 = 0603WAF4701T5E: 电阻类型:厚膜电阻;阻值:4.7kΩ;精度:±1%;功率:100mW;最大工作电压:75V;温度系数:±100ppm/℃;; LCSC Part Name: 4.7kΩ ±1% 100mW 厚膜电阻; Supplier Part: C23162; Manufacturer: UNI-ROYAL(厚声); Supplier Footprint: 0603; JLCPCB Part Class: 基础库; Datasheet: https://atta.szlcsc.com/upload/public/pdf/source/20200306/C422600_1E6D84923E4A46A82E41ADD87F860B5C.pdf; Supplier: LCSC; Type: 厚膜电阻; Tolerance: ±1%; Power(Watts): 100mW; Overload Voltage (Max): 75V; Temperature Coefficient: ±100ppm/℃; Operating Temperature Range: -55℃~+155℃
R30 R31 R43 R44 = 0603WAF220JT5E: 电阻类型:厚膜电阻;阻值:22Ω;精度:±1%;功率:100mW;最大工作电压:75V;温度系数:±100ppm/℃;; LCSC Part Name: 22Ω ±1% 100mW 厚膜电阻; Supplier Part: C23345; Manufacturer: UNI-ROYAL(厚声); Supplier Footprint: 0603; JLCPCB Part Class: 基础库; Datasheet: https://atta.szlcsc.com/upload/public/pdf/source/20200306/C422600_1E6D84923E4A46A82E41ADD87F860B5C.pdf; Supplier: LCSC; Type: 厚膜电阻; Tolerance: ±1%; Power(Watts): 100mW; Overload Voltage (Max): 75V; Temperature Coefficient: ±100ppm/℃; Operating Temperature Range: -55℃~+155℃
R53-R58 R60 = 0603WAF330JT5E: 电阻类型:厚膜电阻;阻值:33Ω;精度:±1%;功率:100mW;最大工作电压:75V;温度系数:±100ppm/℃;; LCSC Part Name: 33Ω ±1% 100mW 厚膜电阻; Supplier Part: C23140; Manufacturer: UNI-ROYAL(厚声); Supplier Footprint: 0603; JLCPCB Part Class: 基础库; Datasheet: https://atta.szlcsc.com/upload/public/pdf/source/20200306/C422600_1E6D84923E4A46A82E41ADD87F860B5C.pdf; Supplier: LCSC; Type: 厚膜电阻; Tolerance: ±1%; Power(Watts): 100mW; Overload Voltage (Max): 75V; Temperature Coefficient: ±100ppm/℃; Operating Temperature Range: -55℃~+155℃
R63 = 0603WAF100KT5E: 电阻类型:厚膜电阻;阻值:1Ω;精度:±1%;功率:100mW;最大工作电压:75V;温度系数:±400ppm/℃;; LCSC Part Name: 1Ω ±1% 100mW 厚膜电阻; Supplier Part: C22936; Manufacturer: UNI-ROYAL(厚声); Supplier Footprint: 0603; JLCPCB Part Class: 基础库; Datasheet: https://atta.szlcsc.com/upload/public/pdf/source/20200306/C422600_1E6D84923E4A46A82E41ADD87F860B5C.pdf; Supplier: LCSC; Type: 厚膜电阻; Tolerance: ±1%; Power(Watts): 100mW; Overload Voltage (Max): 75V; Temperature Coefficient: ±400ppm/℃; Operating Temperature Range: -55℃~+155℃
R69 = RC0603FR-071KL: 电阻类型:厚膜电阻;阻值:1kΩ;精度:±1%;功率:100mW;最大工作电压:75V;温度系数:±100ppm/℃;; LCSC Part Name: 厚膜电阻 1kΩ ±1% 100mW; Supplier Part: C22548; Manufacturer: YAGEO(国巨); Supplier Footprint: 0603; JLCPCB Part Class: 扩展库; Datasheet: https://atta.szlcsc.com/upload/public/pdf/source/20180316/70C0E2BDAE7FCC62C531A5A58D202EE1.pdf; Supplier: LCSC; Type: 厚膜电阻; Tolerance: ±1%; Power(Watts): 100mW; Overload Voltage (Max): 75V; Temperature Coefficient: ±100ppm/℃; Operating Temperature Range: -55℃~+155℃
R70 = RC0603FR-074K7L: 电阻类型:厚膜电阻;阻值:4.7kΩ;精度:±1%;功率:100mW;最大工作电压:75V;温度系数:±100ppm/℃;; LCSC Part Name: 厚膜电阻 4.7kΩ ±1% 100mW; Supplier Part: C99782; Manufacturer: YAGEO(国巨); Supplier Footprint: 0603; JLCPCB Part Class: 扩展库; Datasheet: https://atta.szlcsc.com/upload/public/pdf/source/20180224/C181757_15194369480721363983.pdf; Supplier: LCSC; Type: 厚膜电阻; Tolerance: ±1%; Power(Watts): 100mW; Overload Voltage (Max): 75V; Temperature Coefficient: ±100ppm/℃; Operating Temperature Range: -55℃~+155℃
RN9-RN12 = 4D03WGJ0330T5E: 电阻器数:4;阻值:33Ω;精度:±5%;单个元件功率:62.5mW;温度系数:±200ppm/℃;; LCSC Part Name: 33Ω ±5%; Supplier Part: C25508; Manufacturer: UNI-ROYAL(厚声); Supplier Footprint: 0603x4; JLCPCB Part Class: 扩展库; Datasheet: https://atta.szlcsc.com/upload/public/pdf/source/20191224/C474318_2527498AE30E813171187CCD28401A71.pdf; Supplier: LCSC; Number of Resistors: 4; Tolerance: ±5%; Power(Watts): 62.5mW; Temperature Coefficient: ±200ppm/℃; Number of Pins: 8
TP11 TP12 = TP
U12 = CH340C: 应用功能:收发器;接口协议:USB 2.0;数据速率:2Mbps;; LCSC Part Name: CH340C USB转串口芯片 CH340; Supplier Part: C84681; Manufacturer: WCH(南京沁恒); Supplier Footprint: SOP-16; JLCPCB Part Class: 扩展库; Datasheet: https://atta.szlcsc.com/upload/public/pdf/source/20200819/C84681_ADBED554CE321879DBD6B1D06488689C.pdf; Supplier: LCSC; Applications Function: 收发器; Protocol: USB 2.0; Supply Voltage: 3.3V；5V; Data Rate: 2Mbps
U18 = XPT2046: 触摸屏:-;分辨率（位）:-;接口类型:-;电压基准:-;; Supplier Part: C19076; Manufacturer: XPT(矽普特); Supplier Footprint: TSSOP-16; JLCPCB Part Class: Extended Part; Datasheet: https://atta.szlcsc.com/upload/public/pdf/source/20140801/1457707195762.pdf; Supplier: LCSC
USB2 USB3 = TYPE-C 16PIN 2MD(073): 连接器类型:Type-C;标准:-;公母:母;端口数量:1;触点数量:16P;安装方式:卧贴;额定电流 - 电源:5A;工作温度范围:-25℃~+85℃;; LCSC Part Name: Type-C 母 卧贴; Supplier Part: C2765186; Manufacturer: SHOU HAN(首韩); Supplier Footprint: SMD; JLCPCB Part Class: 扩展库; Datasheet: https://atta.szlcsc.com/upload/public/pdf/source/20211123/39B17C16241EAC15C5E277BDA434118E.pdf; Supplier: LCSC; Connector Type: Type-C; Gender: 母; Number of Ports: 1; Number of Contacts: 16P; Mounting Style: 卧贴; Current Rating - Power (Max): 5A; Operating Temperature Range: -25℃~+85℃
C73 = CGA0805X5R226M350MT: 容值:22uF;精度:±20%;额定电压:35V;材质(温度系数):X5R;; LCSC Part Name: 22uF ±20% 35V; Supplier Part: C6119901; Manufacturer: HRE(芯声); Supplier Footprint: 0805; JLCPCB Part Class: 扩展库; Datasheet: https://atta.szlcsc.com/upload/public/pdf/source/20231129/D589D0CC4D260F7AC3A77E53B455CCB3.pdf; Supplier: LCSC; Tolerance: ±20%; Voltage Rated: 35V; Temperature Coefficient: X5R
H7 = PZ254V-11-06P: 插针结构:1x6P;间距:2.54mm;行距:-;圆针/方针:方针;安装类型:直插;排数:单排;总PIN位数:6P;额定电流:-;额定电压:-;配合针长度:6mm;塑高:2.5mm;端接针长度:3mm;触头材质:黄铜;触头镀层:-;工作温度范围:-40℃~+105℃;颜色:黑色;; LCSC Part Name: 间距:2.54mm 1x6P 直插 方针; Supplier Part: C492405; Manufacturer: XFCN(兴飞); Supplier Footprint: 插件,P=2.54mm; JLCPCB Part Class: 扩展库; Datasheet: https://atta.szlcsc.com/upload/public/pdf/source/20200309/C492405_597F1930F5B55CC3C7FD95458F1C3977.pdf; Supplier: LCSC; Pin Structure: 1x6P; Pitch: 2.54mm; Circluar Pins/Square Pins: 方针; Mounting Type: 直插; Number of Rows: 单排; Number of Pins: 6P; Length of Mating Pin: 6mm; Insulation Height: 2.5mm; Length of End Connection Pin: 3mm; Contact Material: 黄铜; Operating Temperature Range: -40℃~+105℃; Color: 黑色
U15 = XL9555: 接口:-;; LCSC Part Name: 具有中断输出和配置寄存器 16位I2C总线和SMBus I/O端口扩展器; Supplier Part: C609791; Manufacturer: XINLUDA(信路达); Supplier Footprint: TSSOP-24; JLCPCB Part Class: 扩展库; Datasheet: https://atta.szlcsc.com/upload/public/pdf/source/20221111/F6A27DC517C60CF7BC3ED74C539C74FA.pdf; Supplier: LCSC
U21 = ESP32-S3-WROOM-1-N16R8: LCSC Part Name: 通用型Wi-Fi+低功耗蓝牙MCU模组; Supplier Part: C2913202; Manufacturer: ESPRESSIF(乐鑫); Supplier Footprint: SMD,18x25.5mm; JLCPCB Part Class: 扩展库; Datasheet: https://atta.szlcsc.com/upload/public/pdf/source/20220705/4E799F39581577F766659887F738A439.pdf; Supplier: LCSC
C34 C39 = CL10B474KA8NNNC: 容值:470nF;精度:±10%;额定电压:25V;材质(温度系数):X7R;; LCSC Part Name: 470nF ±10% 25V; Supplier Part: C1623; Manufacturer: SAMSUNG(三星); Supplier Footprint: 0603; JLCPCB Part Class: Basic Part; Datasheet: https://atta.szlcsc.com/upload/public/pdf/source/20160103/1457707685435.pdf; Supplier: LCSC; Tolerance: ±10%; Voltage Rated: 25V; Temperature Coefficient: X7R; Check: true
C40 C144 = CL10B224KA8NNNC: 容值:220nF;精度:±10%;额定电压:25V;材质(温度系数):X7R;; LCSC Part Name: 220nF ±10% 25V; Supplier Part: C21120; Manufacturer: SAMSUNG(三星); Supplier Footprint: 0603; JLCPCB Part Class: Basic Part; Datasheet: https://atta.szlcsc.com/upload/public/pdf/source/20160103/1457707705031.pdf; Supplier: LCSC; Tolerance: ±10%; Voltage Rated: 25V; Temperature Coefficient: X7R
C145 = 0603B103K500NT: 容值:10nF;精度:±10%;额定电压:50V;材质(温度系数):X7R;; LCSC Part Name: 10nF ±10% 50V; Supplier Part: C57112; Manufacturer: FH(风华); Supplier Footprint: 0603; JLCPCB Part Class: Basic Part; Datasheet: https://atta.szlcsc.com/upload/public/pdf/source/20170923/C57112_1506149495135988846.pdf; Supplier: LCSC; Tolerance: ±10%; Voltage Rated: 50V; Temperature Coefficient: X7R
C146 = 0603B222K500NT: 容值:2.2nF;精度:±10%;额定电压:50V;材质(温度系数):X7R;; LCSC Part Name: 2.2nF ±10% 50V; Supplier Part: C1604; Manufacturer: FH(风华); Supplier Footprint: 0603; JLCPCB Part Class: Basic Part; Datasheet: https://atta.szlcsc.com/upload/public/pdf/source/20170923/C1604_1506149289438988405.pdf; Supplier: LCSC; Tolerance: ±10%; Voltage Rated: 50V; Temperature Coefficient: X7R
C147 = CL10C101JB8NNNC: 容值:100pF;精度:±5%;额定电压:50V;材质(温度系数):C0G;; LCSC Part Name: 100pF ±5% 50V; Supplier Part: C14858; Manufacturer: SAMSUNG(三星); Supplier Footprint: 0603; JLCPCB Part Class: Basic Part; Datasheet: https://atta.szlcsc.com/upload/public/pdf/source/20160103/1457707672333.pdf; Supplier: LCSC; Tolerance: ±5%; Voltage Rated: 50V; Temperature Coefficient: C0G
D2 = SMFJ5.0CA_C152064: 反向截止电压(Vrwm):5V;最大钳位电压:9.2V;峰值脉冲电流(Ipp)@10/1000us:21.7A;击穿电压:6.4V;; Supplier Part: C152064; Manufacturer: BORN(伯恩半导体); Supplier Footprint: SOD-123F; JLCPCB Part Class: 扩展库; Datasheet: https://atta.szlcsc.com/upload/public/pdf/source/20181211/C152064_2CFB5B95395FB4F205D55C4FF132895F.pdf; Supplier: LCSC; Reverse Stand-Off Voltage (Vrwm): 5V; Maximum Clamping Voltage: 9.2V; Peak Pulse Current (Ipp)@10/1000us: 21.7A; Breakdown Voltage: 6.4V; Type: TVS
D3 = SMFJ3.3CA: SOD-123 200W  VRWM=3.3V 双向 功率TVS 电源口等; Supplier Part: C511919; Manufacturer: BORN(伯恩半导体); Supplier Footprint: SOD-123; JLCPCB Part Class: 扩展库; Datasheet: https://atta.szlcsc.com/upload/public/pdf/source/20220819/7A7ECAA22EB2D2C0D7168D96D0DEA0BB.pdf; Supplier: LCSC; Type: ESD
F1 = BSMD0805-100-6V: 最大电压:6V;最大电流:40A;保持电流:1A;跳闸电流:2A;; LCSC Part Name: 6V 1A 0805自恢复; Supplier Part: C883112; Manufacturer: BHFUSE(佰宏); Supplier Footprint: 0805; JLCPCB Part Class: 扩展库; Datasheet: https://atta.szlcsc.com/upload/public/pdf/source/20230512/7A46D6CD923C15CBB98FD769C08EDD80.pdf; Supplier: LCSC; Operating Voltage (Max): 6V; Current Rating (Max): 40A; Hold Current: 1A; Trip Current: 2A; Power Dissipation: 600mW; Resistance - Initial (Ri) (Min): 40mΩ; Resistance - Post Trip (R1) (Max): 270mΩ; Maximum Time to Trip: 300ms; Operating Temperature: -40℃~+85℃
H2 H3 = PZ254V-12-6P: 插针结构:2x3P;间距:2.54mm;行距:2.54mm;圆针/方针:方针;安装类型:直插;排数:双排;总PIN位数:6P;额定电流:-;额定电压:-;配合针长度:6mm;塑高:2.5mm;端接针长度:3mm;触头材质:黄铜;触头镀层:-;工作温度范围:-40℃~+105℃;颜色:黑色;; LCSC Part Name: 间距:2.54mm 2x3P 直插 方针; Supplier Part: C492420; Manufacturer: XFCN(兴飞); Supplier Footprint: 插件,P=2.54mm; JLCPCB Part Class: 扩展库; Datasheet: https://atta.szlcsc.com/upload/public/pdf/source/20200309/C492420_BAECB307B001054C09D200388220EAE6.pdf; Supplier: LCSC; Pin Structure: 2x3P; Pitch: 2.54mm; Row Spacing: 2.54mm; Circluar Pins/Square Pins: 方针; Mounting Type: 直插; Number of Rows: 双排; Number of Pins: 6P; Length of Mating Pin: 6mm; Insulation Height: 2.5mm; Length of End Connection Pin: 3mm; Contact Material: 黄铜; Operating Temperature Range: -40℃~+105℃; Color: 黑色
R117 R120 = 0603WAF1203T5E: 电阻类型:厚膜电阻;阻值:120kΩ;精度:±1%;功率:100mW;最大工作电压:75V;温度系数:±100ppm/℃;; LCSC Part Name: 120kΩ ±1% 100mW 厚膜电阻; Supplier Part: C25808; Manufacturer: UNI-ROYAL(厚声); Supplier Footprint: 0603; JLCPCB Part Class: 基础库; Datasheet: https://atta.szlcsc.com/upload/public/pdf/source/20200306/C422600_1E6D84923E4A46A82E41ADD87F860B5C.pdf; Supplier: LCSC; Type: 厚膜电阻; Tolerance: ±1%; Power(Watts): 100mW; Overload Voltage (Max): 75V; Temperature Coefficient: ±100ppm/℃; Operating Temperature Range: -55℃~+155℃
R121 = 0603WAF2402T5E: 电阻类型:厚膜电阻;阻值:24kΩ;精度:±1%;功率:100mW;最大工作电压:75V;温度系数:±100ppm/℃;; LCSC Part Name: 24kΩ ±1% 100mW 厚膜电阻; Supplier Part: C23352; Manufacturer: UNI-ROYAL(厚声); Supplier Footprint: 0603; JLCPCB Part Class: 基础库; Datasheet: https://atta.szlcsc.com/upload/public/pdf/source/20200306/C422600_1E6D84923E4A46A82E41ADD87F860B5C.pdf; Supplier: LCSC; Type: 厚膜电阻; Tolerance: ±1%; Power(Watts): 100mW; Overload Voltage (Max): 75V; Temperature Coefficient: ±100ppm/℃; Operating Temperature Range: -55℃~+155℃
R153 R154 = 0603WAF2201T5E: 电阻类型:厚膜电阻;阻值:2.2kΩ;精度:±1%;功率:100mW;; LCSC Part Name: 2.2kΩ ±1% 100mW; Supplier Part: C4190; Manufacturer: UNI-ROYAL(厚声); Supplier Footprint: 0603; JLCPCB Part Class: Basic Part; Datasheet: https://atta.szlcsc.com/upload/public/pdf/source/20200306/C422600_1E6D84923E4A46A82E41ADD87F860B5C.pdf; Supplier: LCSC; Type: 厚膜电阻; Tolerance: ±1%; Power(Watts): 100mW; Temperature Coefficient: ±100ppm/℃; Overload Voltage (Max): 75V; Operating Temperature Range: -55℃~+155℃
R155 R156 = 0603WAF2002T5E: 电阻类型:厚膜电阻;阻值:20kΩ;精度:±1%;功率:100mW;; LCSC Part Name: 20kΩ ±1% 100mW; Supplier Part: C4184; Manufacturer: UNI-ROYAL(厚声); Supplier Footprint: 0603; JLCPCB Part Class: Basic Part; Datasheet: https://atta.szlcsc.com/upload/public/pdf/source/20200306/C422600_1E6D84923E4A46A82E41ADD87F860B5C.pdf; Supplier: LCSC; Type: 厚膜电阻; Tolerance: ±1%; Power(Watts): 100mW; Temperature Coefficient: ±100ppm/℃; Overload Voltage (Max): 75V; Operating Temperature Range: -55℃~+155℃
R157 R158 = 0603WAF1002T5E: 电阻类型:厚膜电阻;阻值:10kΩ;精度:±1%;功率:100mW;; LCSC Part Name: 厚膜电阻 10kΩ ±1% 100mW; Supplier Part: C25804; Manufacturer: UNI-ROYAL(厚声); Supplier Footprint: 0603; JLCPCB Part Class: Basic Part; Datasheet: https://atta.szlcsc.com/upload/public/pdf/source/20200306/C422600_1E6D84923E4A46A82E41ADD87F860B5C.pdf; Supplier: LCSC; Type: 厚膜电阻; Tolerance: ±1%; Power(Watts): 100mW; Overload Voltage (Max): 75V; Temperature Coefficient: ±100ppm/℃; Operating Temperature Range: -55℃~+155℃
R159 = 0603WAF4301T5E: 电阻类型:厚膜电阻;阻值:4.3kΩ;精度:±1%;功率:100mW;; LCSC Part Name: 4.3kΩ ±1% 100mW; Supplier Part: C23159; Manufacturer: UNI-ROYAL(厚声); Supplier Footprint: 0603; JLCPCB Part Class: Basic Part; Datasheet: https://atta.szlcsc.com/upload/public/pdf/source/20200306/C422600_1E6D84923E4A46A82E41ADD87F860B5C.pdf; Supplier: LCSC; Type: 厚膜电阻; Tolerance: ±1%; Power(Watts): 100mW; Temperature Coefficient: ±100ppm/℃; Overload Voltage (Max): 75V; Operating Temperature Range: -55℃~+155℃
U7 U8 = RT9013-33GB: 输出类型:固定;最大输入电压:5.5V;输出电压:3.3V;最大输出电流:500mA;电源纹波抑制比(PSRR):50dB@(10kHz);输出极性:正极;; LCSC Part Name: 输入5.5V 输出3.3V 500mA; Supplier Part: C47773; Manufacturer: RICHTEK(立锜); Supplier Footprint: SOT-23-5; JLCPCB Part Class: 扩展库; Datasheet: https://atta.szlcsc.com/upload/public/pdf/source/20150504/1457707282459.pdf; Supplier: LCSC; Output Type: 固定; Maximum Input Voltage: 5.5V; Output Voltage: 3.3V; MAX Output Current: 500mA; Power Supply Rejection Ratio (PSRR): 50dB@(10kHz); Dropout Voltage: 400mV@(500mA); standby current: 50uA; Operating Temperature: -40℃~+85℃; Output Polarity: 正极; Number of Outputs: 1
U9 = SS-12F44-G5: 电路结构:单刀双掷;安装方式:直插;开关颜色:黑色;机械寿命:-;; LCSC Part Name: 拨动开关; Supplier Part: C2998807; Manufacturer: DEALON(德艺隆); Supplier Footprint: 插件; JLCPCB Part Class: 扩展库; Datasheet: https://atta.szlcsc.com/upload/public/pdf/source/20220428/590A0165C728230C4E39516860AD3726.pdf; Supplier: LCSC; Circuit: 单刀双掷; Actuator Style: 矩形柱状; Pin Style: PC引脚; Switch Length: 12.2mm; Switch Width: 5.9mm; Switch Height: 11mm; Mounting Style: 直插; Actuator Color: 黑色
U24 U25 = ME6221CM5G: 输出类型:-;; Supplier Part: C236642; Manufacturer: MICRONE(南京微盟); Supplier Footprint: SOT-23-5; JLCPCB Part Class: 扩展库; Datasheet: https://atta.szlcsc.com/upload/public/pdf/source/20180904/C236642_0943912D5C0737D6F263D814737DF664.pdf; Supplier: LCSC

## Nets
AGND: C92.1 C93.1 C94.1 C95.1 C96.1 C97.1 C100.1 C101.1 C102.1 C103.1 C104.1 C105.1 C106.2 C107.1 C108.1 C109.1 C110.1 C111.1 C112.1 C113.1 C116.1 C117.1 C120.1 C121.1 C122.1 C123.1 C124.1 C125.1 C126.1 C127.1 C130.2 C131.2 C132.1 C133.2 C134.2 C135.1 C136.1 C137.2 C138.1 C139.1 C140.1 C142.1 R136.2 R139.1 R141.1 R145.1 R146.1 R147.1 R148.1 R170.1 U26.10(AGND) U26.21(EP) U29.8(GNDD) U29.21(GNDA) U29.33(EP) U30.7(GND) U31.2(GND) U31.3(GND) U32.2(GND) U32.3(GND)
GND: BOOT5.3 BOOT5.4 C1.2 C4.1 C10.1 C11.1 C12.1 C13.1 C14.1 C15.1 C16.1 C35.2 C36.2 C37.2 C38.1 C41.2 C69.1 C70.1 C73.2 C74.2 C75.1 C76.1 C78.1 C79.1 C80.1 C81.1 C82.1 C83.1 C84.1 C85.1 C86.1 C87.1 C88.2 C89.2 C90.2 C91.1 CARD1.6(VSS) CARD1.10 CARD1.11 CARD1.12 CARD1.13 CN5.3 CN5.4 CN6.1 CN6.5 CN6.6 D2.1 D3.1 FPC5.1 FPC5.7 FPC5.28 FPC5.30 FPC5.40 FPC5.41 FPC5.42 FPC6.2 FPC6.15 FPC6.25 FPC6.26 H2.1 H2.3 H2.5 H3.1 H3.3 H3.5 H5.1 H7.6 H8.4 LED2.1(K) LED3.1(K) LED4.1(K) Q4.2(E) R11.2 R28.1 R29.1 R41.1 R42.1 R62.1 R65.2 R68.2 R70.1 R102.1 R103.1 R104.1 R105.1 R117.1 R120.1 R126.1 R127.1 R164.1 R165.1 R166.1 R167.1 R168.1 R169.1 R170.2 RESET1.3 RESET1.4 U7.2(GND) U8.2(GND) U9.4 U9.5 U12.1(GND) U15.2(A1) U15.3(A2) U15.12(VSS) U15.21(A0) U18.6(GND) U18.8(AUX) U21.1(GND) U21.40(GND) U21.41(GND) U23.4(GND) U24.2(VSS) U25.2(VSS) U26.5(DGND) USB2.1(GND) USB2.12(GND) USB2.13(SHELL) USB2.14(SHELL) USB3.1(GND) USB3.12(GND) USB3.13(SHELL) USB3.14(SHELL)
VCC5: C10.2 C13.2 C36.1 C37.1 C131.1 C132.2 C133.1 CN6.4 D2.2 F1.2 H3.2 H3.4 H3.6 H5.4 U7.1(VIN) U7.3(EN) U8.1(VIN) U8.3(EN) U12.16(VCC) U30.6(VCC)
VCC_1.5: C86.2 C87.2 C89.1 FPC6.10 R121.2 U25.5(VOUT)
VCC_2.8: C81.2 C82.2 C88.1 C90.1 FPC6.4 FPC6.11 R116.2 U24.5(VOUT)
VCC_3.3: C4.2 C11.2 C12.2 C41.1 C69.2 C70.2 C73.1 C74.1 C78.2 C79.2 C83.2 C84.2 CARD1.4(VDD) D3.2 FPC5.6 FPC5.26 FPC5.32 FPC5.36 FPC5.37 H2.2 H2.4 H2.6 H7.1 H8.1 R1.2 R3.1 R7.1 R8.1 R9.1 R13.1 R61.1 R64.1 R66.2 R67.2 R77.1 R78.1 R97.2 R98.2 R99.2 R100.2 R101.2 R108.2 R109.2 R115.2 R118.2 R122.2 R123.2 R124.2 R125.2 U7.5(VOUT) U15.24(VDD) U18.1(VCC) U18.9(VREF) U18.10(IOVDD) U21.2(3V3) U23.8(VCC) U24.1(VIN) U25.1(VIN)
VCC_3.3A: C14.2 C15.2 C94.2 C97.2 C106.1 C107.2 C120.2 R134.2 R135.2 R137.1 R138.1 R140.1 R144.1 U8.5(VOUT) U26.3(PVDD) U26.4(DVDD) U26.11(AVDD) U29.6(VDDP) U29.7(VDDD) U29.22(VDDA) U29.23(VDDM)
ADC_MIC1N: C114.2 R147.2
ADC_MIC1P: C115.2 C136.2 U31.4(OUT)
ADC_MIC2N: C118.1 R148.2
ADC_MIC2P: C119.1 C139.2 U32.4(OUT)
ADC_MIC3N: C40.2 C129.1
ADC_MIC3P: C128.1 C144.2
ADC_MICBIAS12: C121.2 C134.1 C135.2 C137.1 C138.2 U29.24(MICBIAS12) U31.1(VDD) U32.1(VDD)
ADC_MICBIAS34: C123.2 U29.26(MICBIAS34)
BAT_MEAS_ADC: C75.2 CARD1.8(DAT1) R78.2 RN10.4 U21.6(IO6)
BOOT: BOOT5.1 BOOT5.2 D4.2(A) H7.4 R101.1 R105.2 R106.2 R107.2 U21.27(IO0)
BT_ARRAY_ADC: C76.2 KEY0.3 KEY0.4 KEY1.3 KEY1.4 KEY2.3 KEY2.4 KEY3.3 KEY3.4 KEY4.3 KEY4.4 KEY5.3 KEY5.4 R98.1 U21.5(IO5)
CAMERA_D2: FPC5.33 FPC6.19 U21.21(IO13) U23.1(CS#)
CAMERA_D3: FPC6.21 R57.1 U21.24(IO47) U23.2(DO(IO1))
CAMERA_D4: FPC6.22 R60.1 U21.22(IO14) U23.3(WP#(IO2))
CAMERA_D5: CARD1.1(DAT2) FPC6.20 R77.2 RN11.3 U21.15(IO3)
CAMERA_D6: FPC6.18 R56.1 U21.20(IO12) U23.5(DI(IO0))
CAMERA_D7: FPC6.16 R54.1 RN10.3 U21.35(IO42)
CAMERA_D8: FPC5.22 FPC6.14 RN10.2 U21.34(IO41)
CAMERA_D9: FPC5.23 FPC6.12 RN10.1 U21.32(IO39)
CAMERA_HREF: CARD1.2(CD/DAT3) FPC6.9 R7.2 RN11.4 U21.31(IO38)
CAMERA_PCLK: C91.2 FPC6.17 R58.1 U21.19(IO11) U23.7(HOLD#orRESET#(IO3))
CAMERA_PWDN: FPC6.8 R124.1 R127.2
CAMERA_RET: FPC6.6 R125.1 R126.2
CAMERA_SIOC: FPC6.5 R90.1 R123.1
CAMERA_SIOD: FPC6.3 R89.1 R122.1
CAMERA_VSYNC: FPC6.7 R55.1 U21.23(IO21) U23.6(CLK)
CAMERA_XCLK: FPC6.13 U21.33(IO40)
CH340_D+: R31.1 U12.5(D+)
CH340_D-: R30.1 U12.6(D-)
CODEC_I2S0_ASDOUT: U26.7(ASDOUT)
CODEC_I2S0_DSDIN: U21.12(IO8) U26.9(DSDIN)
CODEC_I2S0_LRCK: C96.2 R82.1 R88.1 U26.8(LRCK)
CODEC_I2S0_LRCK_R: R88.2 R95.1
CODEC_I2S0_MCLK: C92.2 R80.1 U26.2(MCLK)
CODEC_I2S0_SCLK: C95.2 R81.1 R87.1 U26.6(SCLK/DMIC_SCL)
CODEC_I2S0_SCLK_R: R87.2 R93.1
DAC_AOUTLN: C98.1 C142.2 C143.2 R161.1
DAC_AOUTLP: C99.1 C140.2 C141.2 R160.1
ES7210_INT: R144.2 R145.2 U29.13(INT)
ES7210_LRCK: C112.2 R82.2 R85.1 U29.10(LRCK)
ES7210_MCLK: C110.2 R83.1 U29.5(MCLK)
ES7210_SCLK: C111.2 R81.2 R84.1 U29.9(SCLK)
ES7210_SDOUT: C113.2 R142.1 R143.1 U21.18(IO10)
ES_I2C_CLK: C93.2 C109.2 H8.2 R90.2 R109.1 R134.1 RN9.8 RN12.4 U15.22(SCL) U21.11(IO18) U26.1(CCLK) U29.4(CCLK)
ES_I2C_SDA: C105.2 C108.2 H8.3 R89.2 R108.1 R135.1 RN9.6 RN12.3 U15.23(SDA) U21.10(IO17) U26.19(CDATA) U29.3(CDATA)
ESP0_BOOT_IO0: R107.1
ESP0_SD_CLK: CARD1.5(CLX) U21.8(IO15)
ESP0_SD_CMD: CARD1.3(CMD) R8.2 U21.7(IO7)
ESP0_SD_DAT0: CARD1.7(DAT0) R9.2 U21.4(IO4)
ESP0_SD_DET: CARD1.CD
ESP_IO1: R95.2 R96.2 U21.39(IO1)
ESP_IO2: R93.2 R94.2 R100.1 R104.2 U21.38(IO2)
ESP_IO9: R84.2 U21.17(IO9)
ESP_IO16: R80.2 R83.2 U21.9(IO16)
ESP_IO45: R85.2 R99.1 R103.2 U21.26(IO45)
ESP_IO46: R73.1 R97.1 R102.2 RN11.1 U21.16(IO46)
ESP_LCD_CLK: R53.1 R96.1
ESP_LCD_CTRL: R69.1 U15.5(IO0_1)
ESP_LCD_DC: FPC5.20 R94.1
ESP_LCD_SDA: R91.1 R106.1 RN11.2
ESP_RXD: H7.3 R171.2 U21.36(RXD0)
ESP_TP_INT: RN9.5 RN12.1 U15.11(IO0_7)
ESP_TP_RST: RN9.7 RN12.2 U15.17(IO1_4)
ESP_TXD: H7.2 R172.2 U21.37(TXD0)
ESP_USB_DM: CN6.3 H5.3 R43.1 U21.13(IO19)
ESP_USB_DP: CN6.2 H5.2 R44.1 R91.2 U21.14(IO20)
GP_LED1: R129.1 U15.19(IO1_6)
GP_LED2: R132.1 U15.20(IO1_7)
IM1: FPC5.24 R65.1 R66.1
IM2: FPC5.25 R67.1 R68.1
LCD_B0: FPC5.17 RN11.8
LCD_B1: FPC5.16 RN11.7
LCD_B2: FPC5.15 RN11.6
LCD_B3: FPC5.14 RN11.5
LCD_B4: FPC5.13 RN10.8
LCD_B5: FPC5.12 RN10.7
LCD_B6: FPC5.11 RN10.6
LCD_B7: FPC5.10 RN10.5
LEDK: FPC5.38 FPC5.39 R63.2
PA_CTRL: R146.2 U15.4(IO0_0) U21.25(IO48) U30.1(CTRL)
PA_INL+: R151.2 U30.3(INP)
PA_INL-: R152.2 U30.4(INN)
PA_OUTL+: R149.1 R162.1 U30.8(VoP)
PA_OUTL-: R150.1 R163.1 U30.5(VON)
PERI_PWR_ON: U15.18(IO1_5)
RESET: C1.1 H7.5 Q3.3(C) R1.1 RESET1.1 RESET1.2 U21.3(EN)
RXD: R172.1 U12.3(RXD)
T_CLK: RN9.1 U18.16(DCLK)
T_CS: RN9.2 U18.15(CS#)
T_MOSI: RN9.3 U18.14(DIN)
T_PEN: R13.2 RN9.4 U18.11(PENIRQ#)
TP_MISO: U18.12(DOUT)
TXD: R171.1 U12.2(TXD)
VUSB: C16.2 C38.2 U9.1 USB2.2(VBUS) USB2.11(VBUS) USB3.2(VBUS) USB3.11(VBUS)
X+: FPC5.3 RN12.7 U18.2(XP)
X-: FPC5.4 RN12.6 U18.4(XN)
Y+: FPC5.5 RN12.5 U18.3(YP)
Y-: FPC5.2 RN12.8 U18.5(YN)
$1N1385: KEY2.1 KEY2.2 R165.2
$1N1462: KEY3.1 KEY3.2 R167.2
$1N1539: KEY4.1 KEY4.2 R168.2
$1N1616: KEY5.1 KEY5.2 R169.2
$1N2176: LED2.2(A) R3.2
$1N17125: KEY1.1 KEY1.2 R166.2
$1N17127: KEY0.1 KEY0.2 R164.2
$1N21278: LED3.2(A) R129.2
$1N21280: LED4.2(A) R132.2
$2N5182: C35.1 U12.4(V3)
$2N5392: Q2.1(B) R26.2
$2N5431: Q3.1(B) R27.2
$2N5479: Q3.2(E) R26.1 U12.14(RTS#)
$2N5498: Q2.2(E) R27.1 U12.13(DTR#)
$2N6206: R28.2 USB2.4(CC1)
$2N6210: R29.2 USB2.10(CC2)
$2N6214: R30.2 USB2.5(DN2) USB2.7(DN1)
$2N6220: R31.2 USB2.6(DP1) USB2.8(DP2)
$2N8864: R41.2 USB3.4(CC1)
$2N8866: R42.2 USB3.10(CC2)
$2N8868: R43.2 USB3.5(DN2) USB3.7(DN1)
$2N8869: R44.2 USB3.6(DP1) USB3.8(DP2)
$2N22378: TP11.1 U18.13(BUSY)
$2N22379: R11.1 TP12.1 U18.7(VBAT)
$2N22428: FPC5.18 R54.2
$2N22431: FPC5.21 R53.2
$2N22434: FPC5.27 R56.2
$2N22437: FPC5.29 R55.2
$2N22442: FPC5.31 R58.2
$2N22448: FPC5.34 R57.2
$2N22451: FPC5.35 R60.2
$2N22455: FPC5.8 R64.2
$2N22525: FPC5.19 R61.2 R62.2
$2N22528: Q4.3(C) R63.1
$2N22534: Q4.1(B) R69.2 R70.2
$2N31648: D4.1(K) Q2.3(C)
$3N21354: R73.2 U15.1(INT#)
$3N21360: TP36.1 U15.6(IO0_2)
$3N21362: TP37.1 U15.7(IO0_3)
$3N21364: TP38.1 U15.8(IO0_4)
$3N21366: TP39.1 U15.9(IO0_5)
$3N21368: TP40.1 U15.10(IO0_6)
$3N21387: TP42.1 U15.16(IO1_3)
$3N21389: TP43.1 U15.15(IO1_2)
$3N21391: TP44.1 U15.14(IO1_1)
$3N21393: TP45.1 U15.13(IO1_0)
$4N13059: TP35.1 U26.17(MIC1N)
$4N13061: C104.2 U26.16(VMID)
$4N13063: C103.2 U26.15(ADCVREF)
$4N13065: C102.2 U26.14(DACVREF)
$4N13067: C99.2 C101.2 U26.12(OUTP)
$4N13068: C98.2 C100.2 U26.13(OUTN)
$4N13069: TP34.1 U26.18(MIC1P/DMIC_SDA)
$4N13088: R136.1 R137.2 U26.20(CE)
$4N13098: R140.2 R141.2 U29.2(AD1)
$4N13101: R138.2 R139.2 U29.1(AD0)
$4N13150: R143.2 U29.12(SDOUT2/TDMIN)
$4N13152: R142.2 U29.11(SDOUT1/TDMOUT)
$4N13180: C114.1 U29.15(MIC1N)
$4N13184: C115.1 U29.16(MIC1P)
$4N13194: C117.2 U29.17(REFP12)
$4N13197: C116.2 U29.18(REFQ12)
$4N13206: C119.2 U29.19(MIC2P)
$4N13208: C118.2 U29.20(MIC2N)
$4N13237: C122.2 U29.25(REFQM)
$4N13242: C124.2 U29.27(MIC4N)
$4N13244: C125.2 U29.28(MIC4P)
$4N13256: C127.2 U29.30(REFQ34)
$4N13258: C126.2 U29.29(REFP34)
$4N13260: C128.2 U29.31(MIC3P)
$4N13262: C129.2 U29.32(MIC3N)
$4N14706: C130.1 U30.2(Bypass)
$4N15595: CN5.2 R149.2 TP32.1
$4N15601: CN5.1 R150.2 TP33.1
$4N15813: C141.1 R151.1
$4N15972: C143.1 R152.1
$5N825: F1.1 U9.2
$5N1587: C80.2 R115.1 U24.3(CE)
$5N1589: R116.1 R117.2 U24.4(FB)
$5N1600: C85.2 R118.1 U25.3(CE)
$5N1602: R120.2 R121.1 U25.4(FB)
$5N2262: C146.2 R155.1 R157.1
$5N2263: C146.1 R156.1 R158.1
$5N2264: C34.1 C145.2 R153.2
$5N2265: C34.2 R157.2
$5N2266: C39.1 C145.1 R154.2
$5N2267: C39.2 R158.2
$5N2268: C144.1 C147.2 R155.2 R159.2
$5N2269: C40.1 C147.1 R156.2 R159.1
$5N2274: R153.1 R160.2 R162.2
$5N2275: R154.1 R161.2 R163.2

Not connected (* = marked no-connect by the designer): FPC5 9*; FPC6 1* 23* 24*; U7 4(NC)*; U8 4(NC)*; U9 3*; U12 7(NC.)* 8(OUT#)* 9(CTS#)* 10(DSR#)* 11(RI#)* 12(DCD#)* 15(R232)*; U21 28(IO35)* 29(IO36)* 30(IO37)*; U29 14(DMIC_CLK)*; USB2 3(SBU2)* 9(SBU1)*; USB3 3(SBU2)* 9(SBU1)*

## Notes on the sheets
sheet 1
- 按键
- 摄像头
- SD卡
- 外接USB摄像头
- LED灯
- NOR FLASH(GUI-芯片)
sheet 2
- UART
- GUI-LCD
- USB
sheet 3
- ESP32-S3
- 扩展IO接口
sheet 4
- 麦克风
- 麦克风/音频驱动芯片
- 功放及喇叭
sheet 5
- 主电源
- 摄像头电源
- AEC
